# EAGLE design NervousSys_V4 (EAGLE 9.1.0)
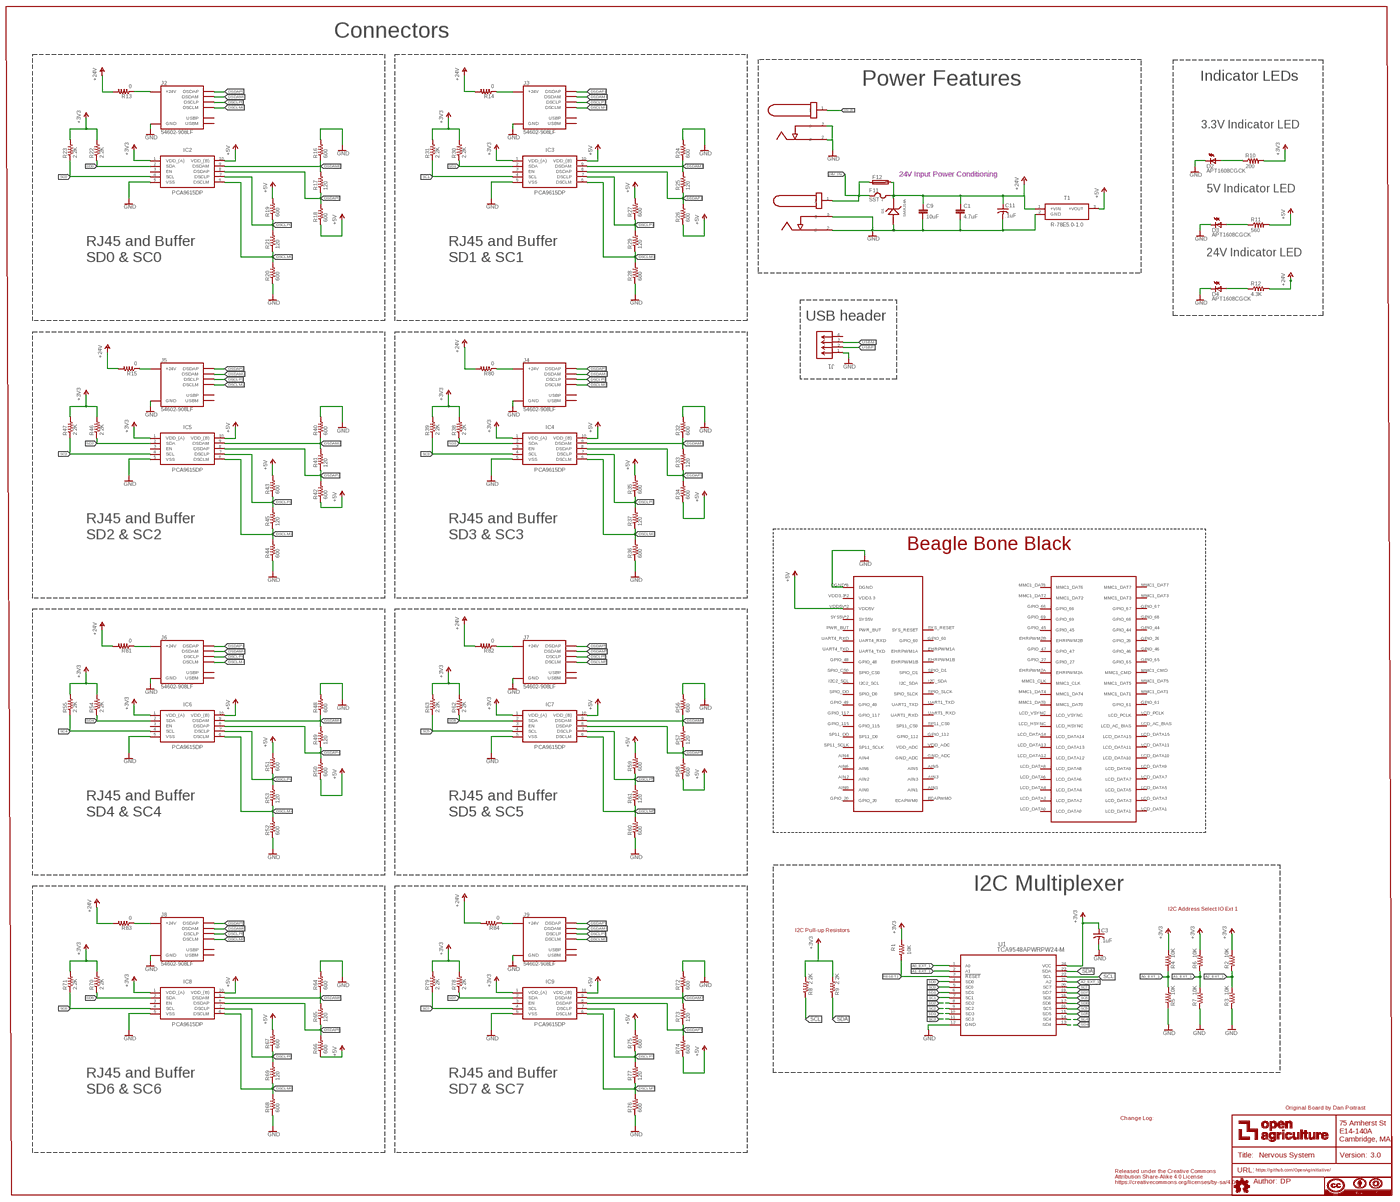
[diagram p0: schematic, sheet 1, overview]
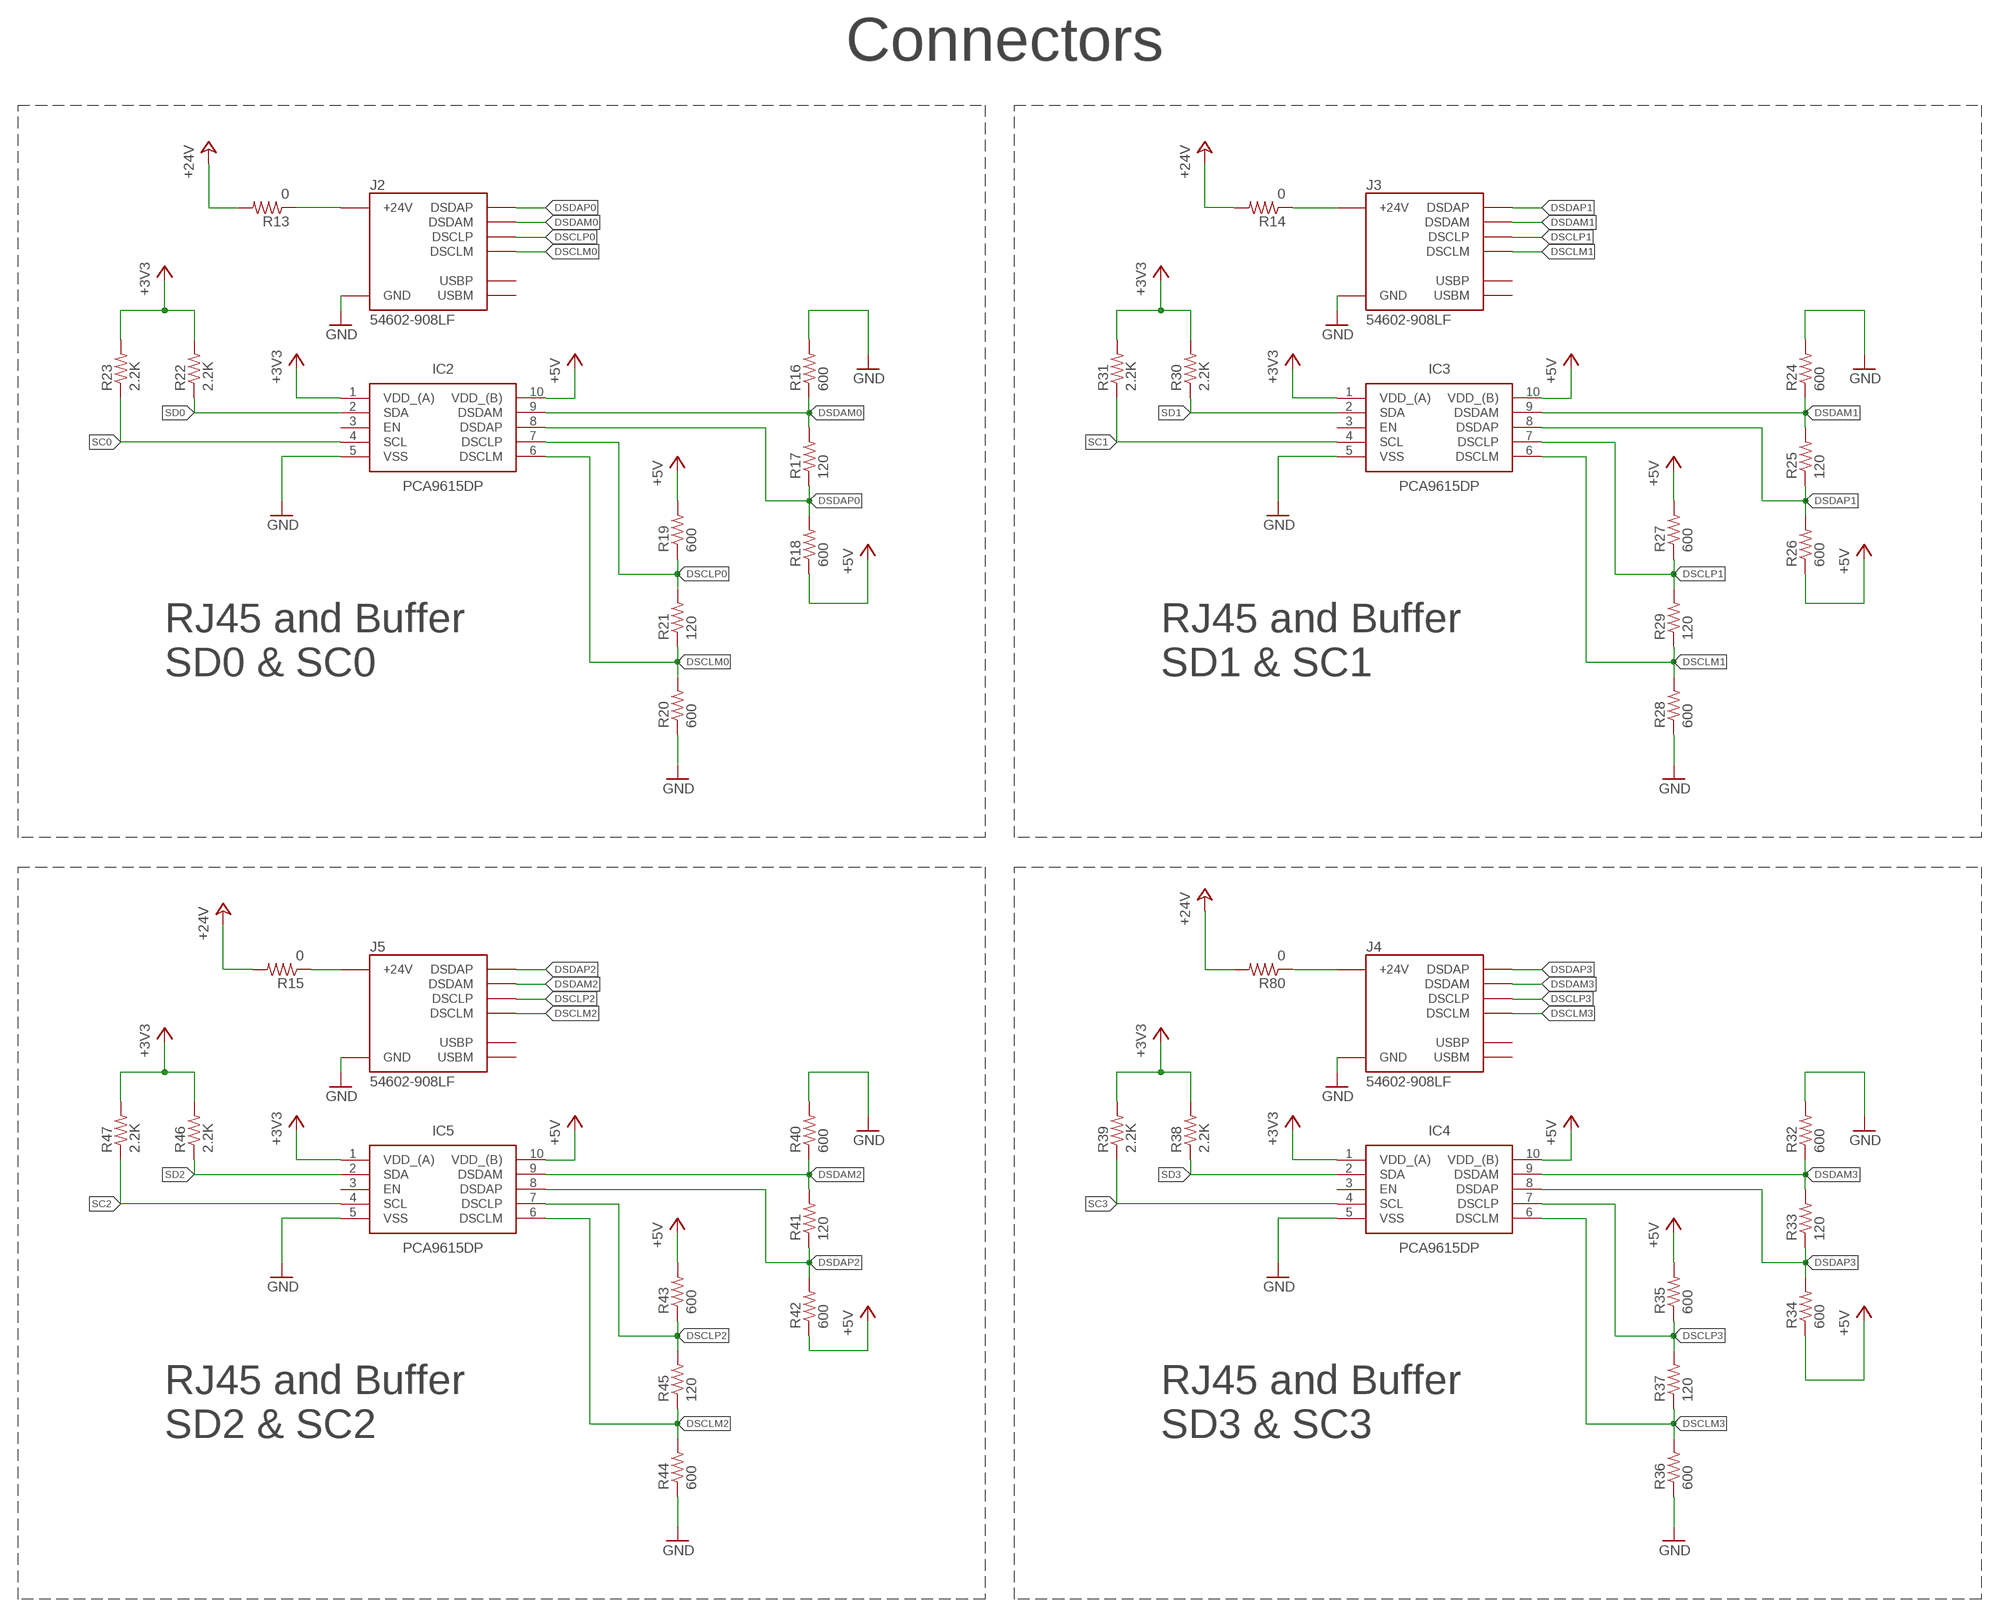
[diagram p1: schematic, sheet 1, part 1 of 4]
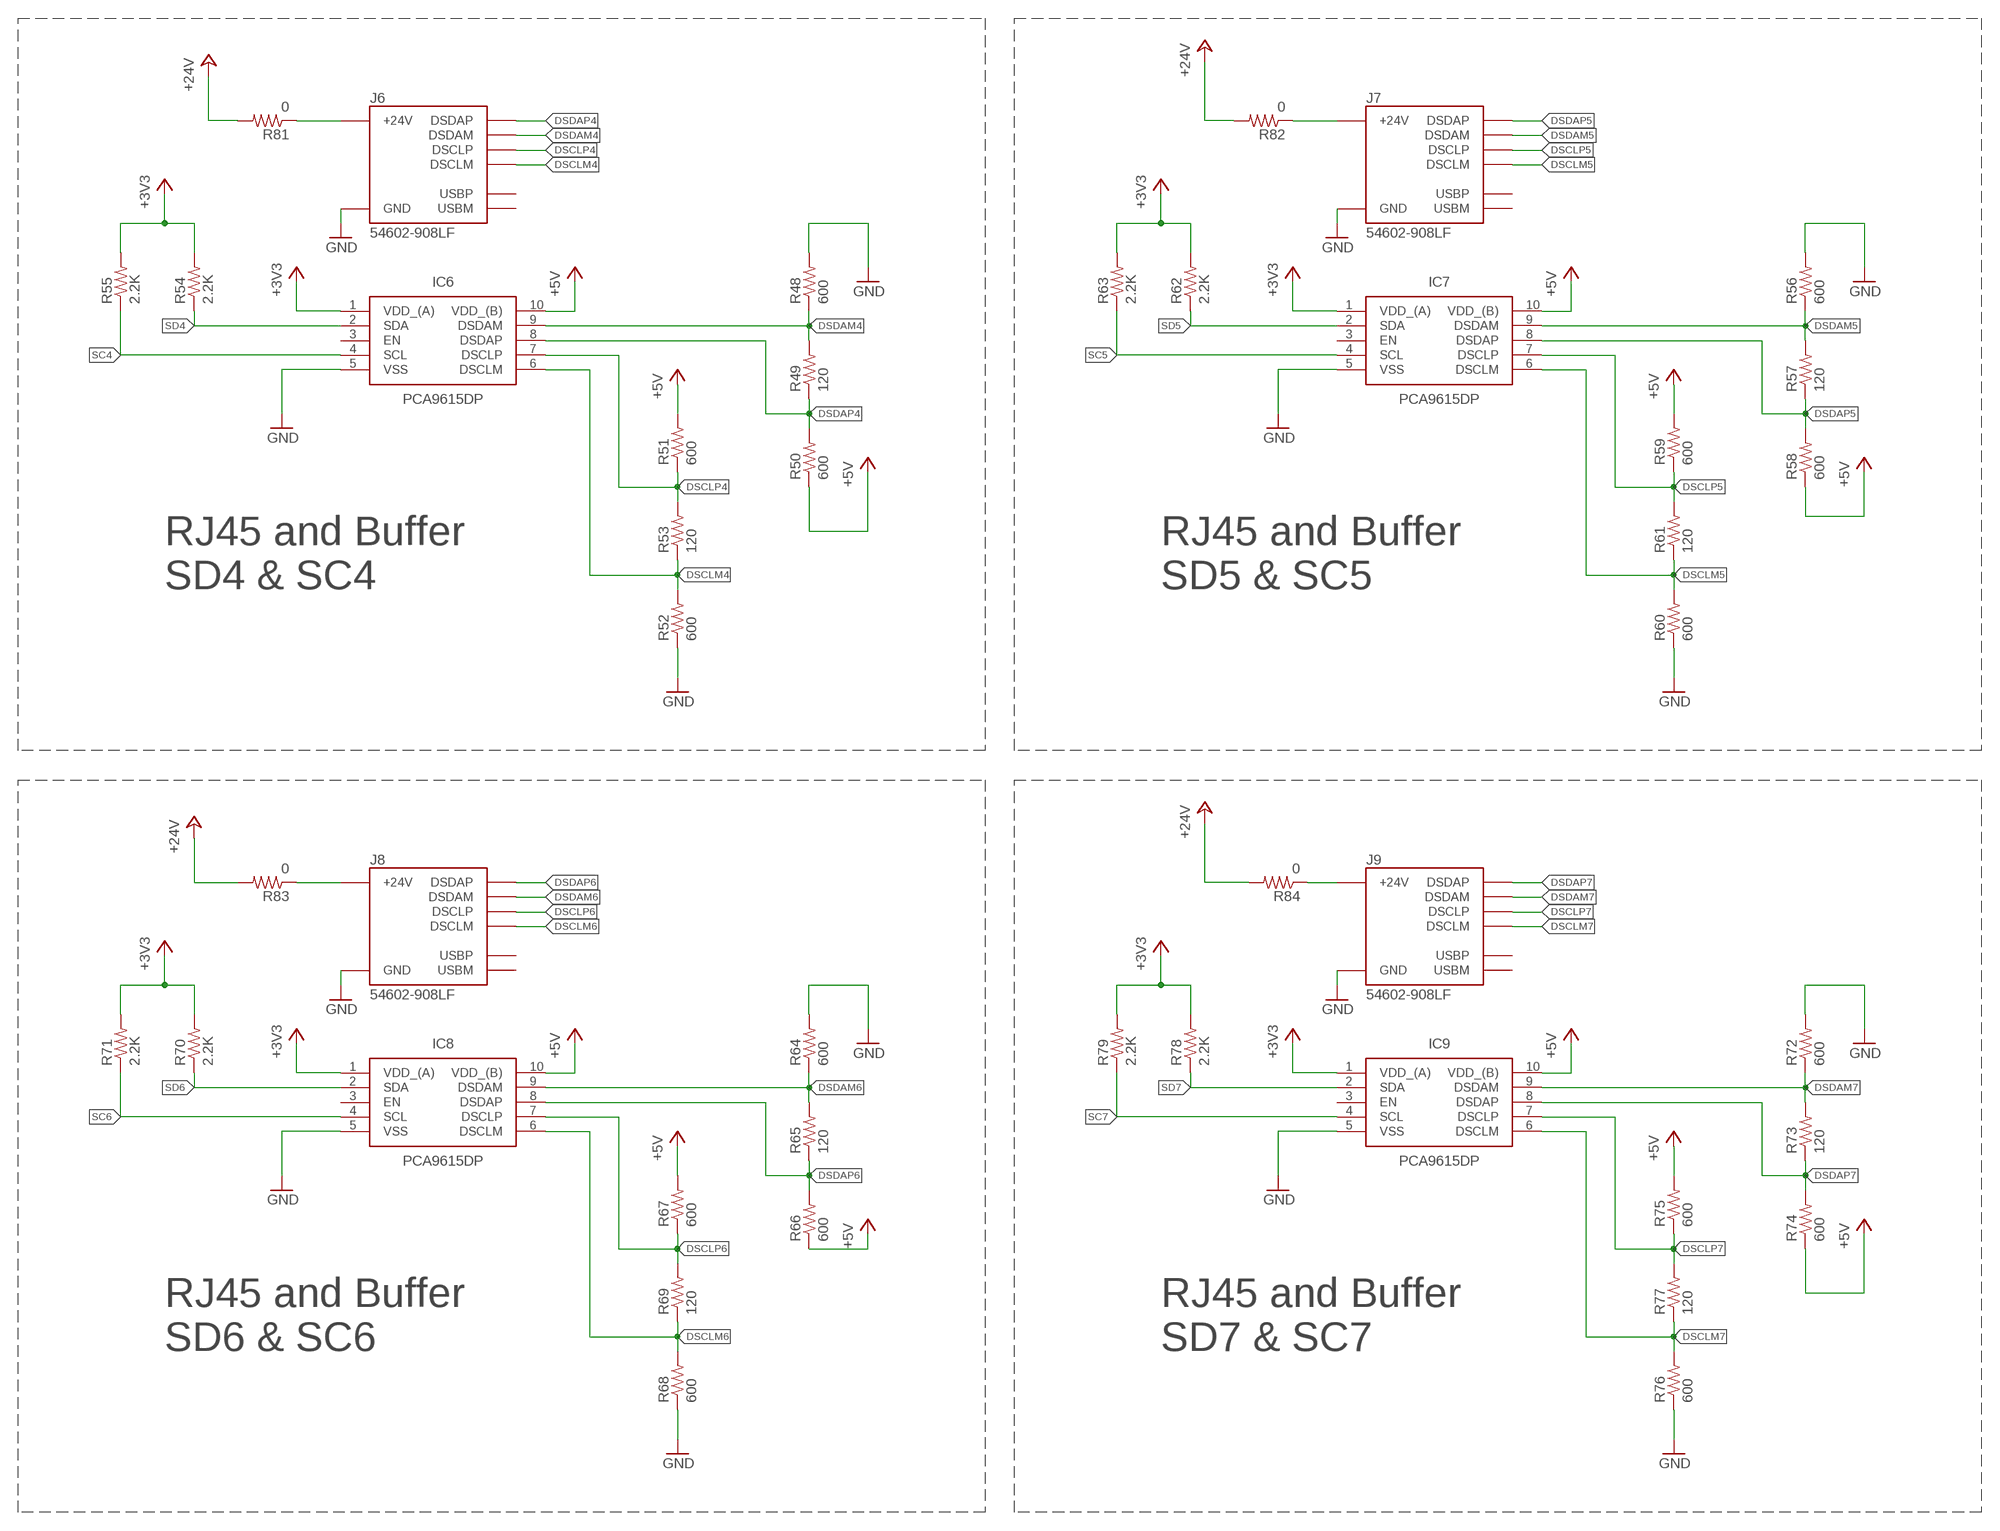
[diagram p2: schematic, sheet 1, part 2 of 4]
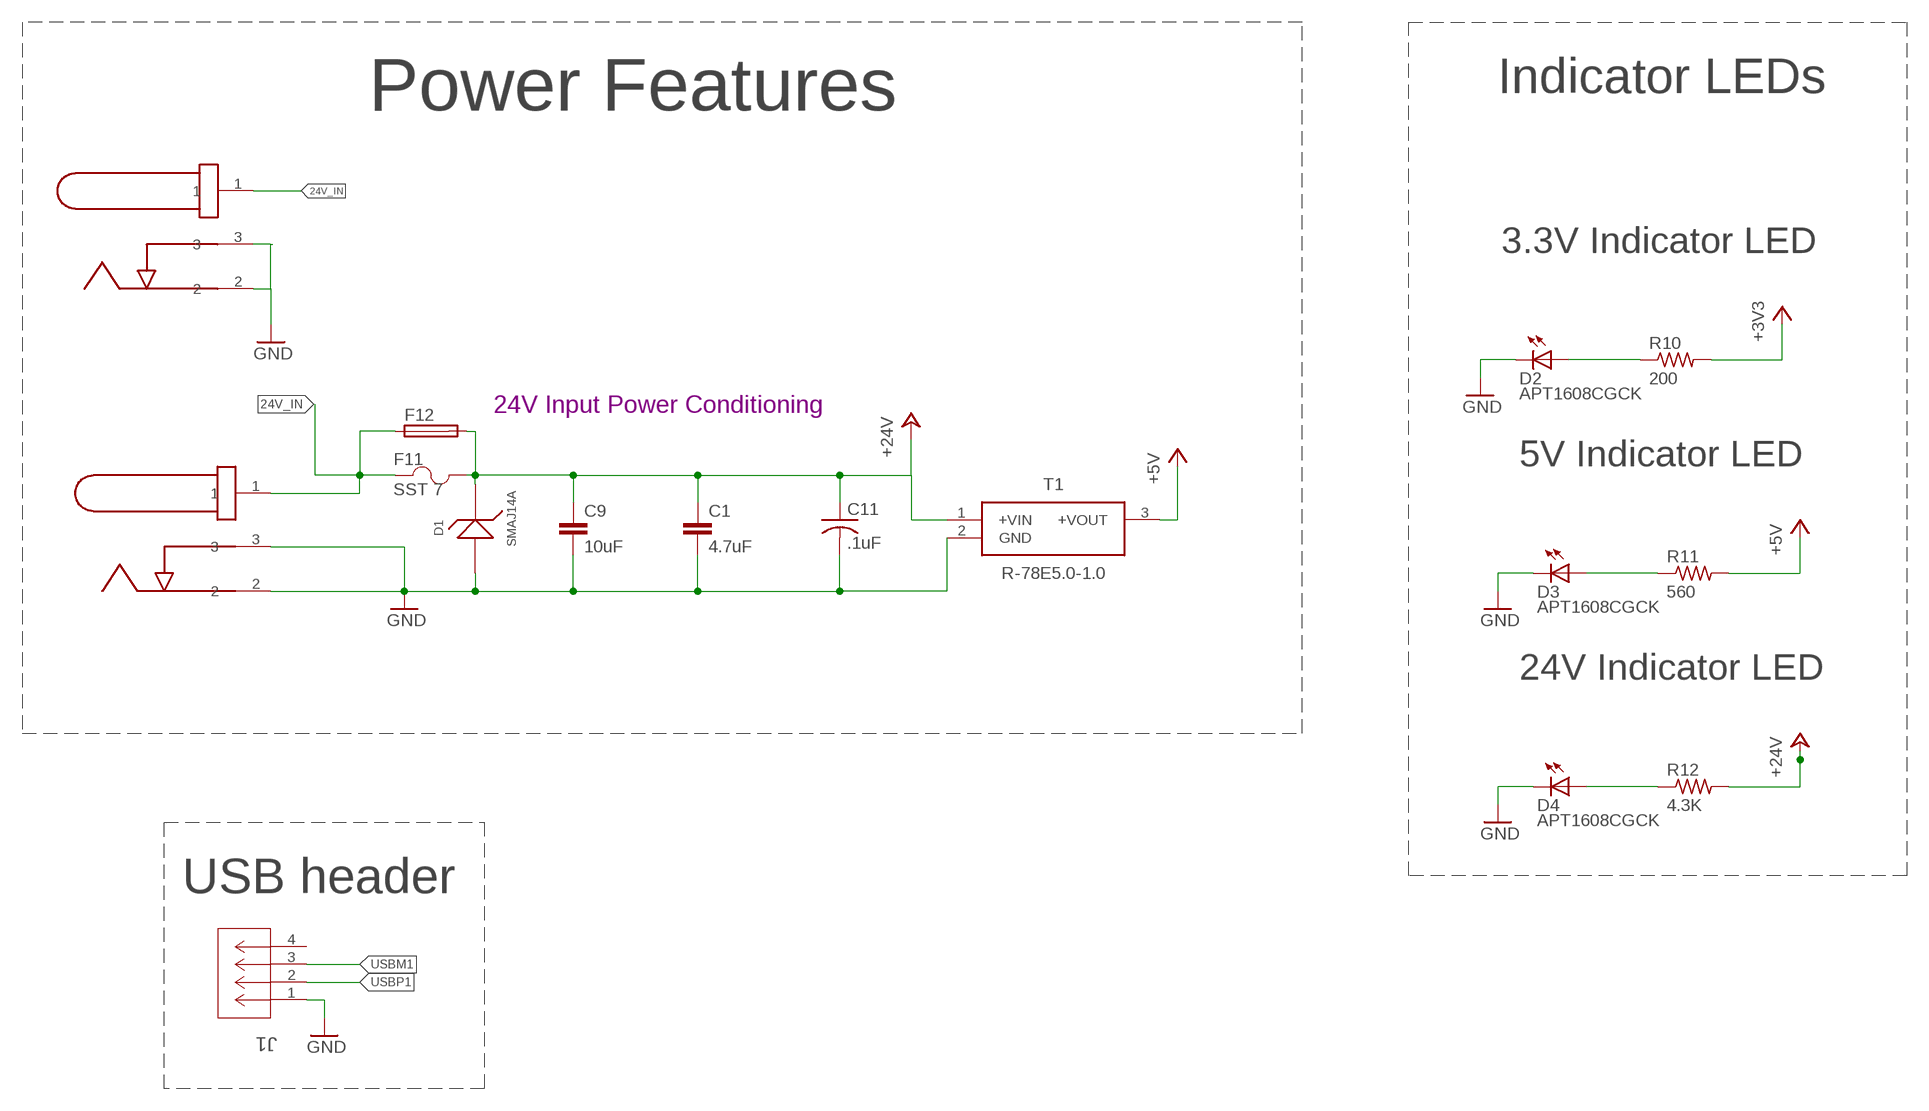
[diagram p3: schematic, sheet 1, part 3 of 4]
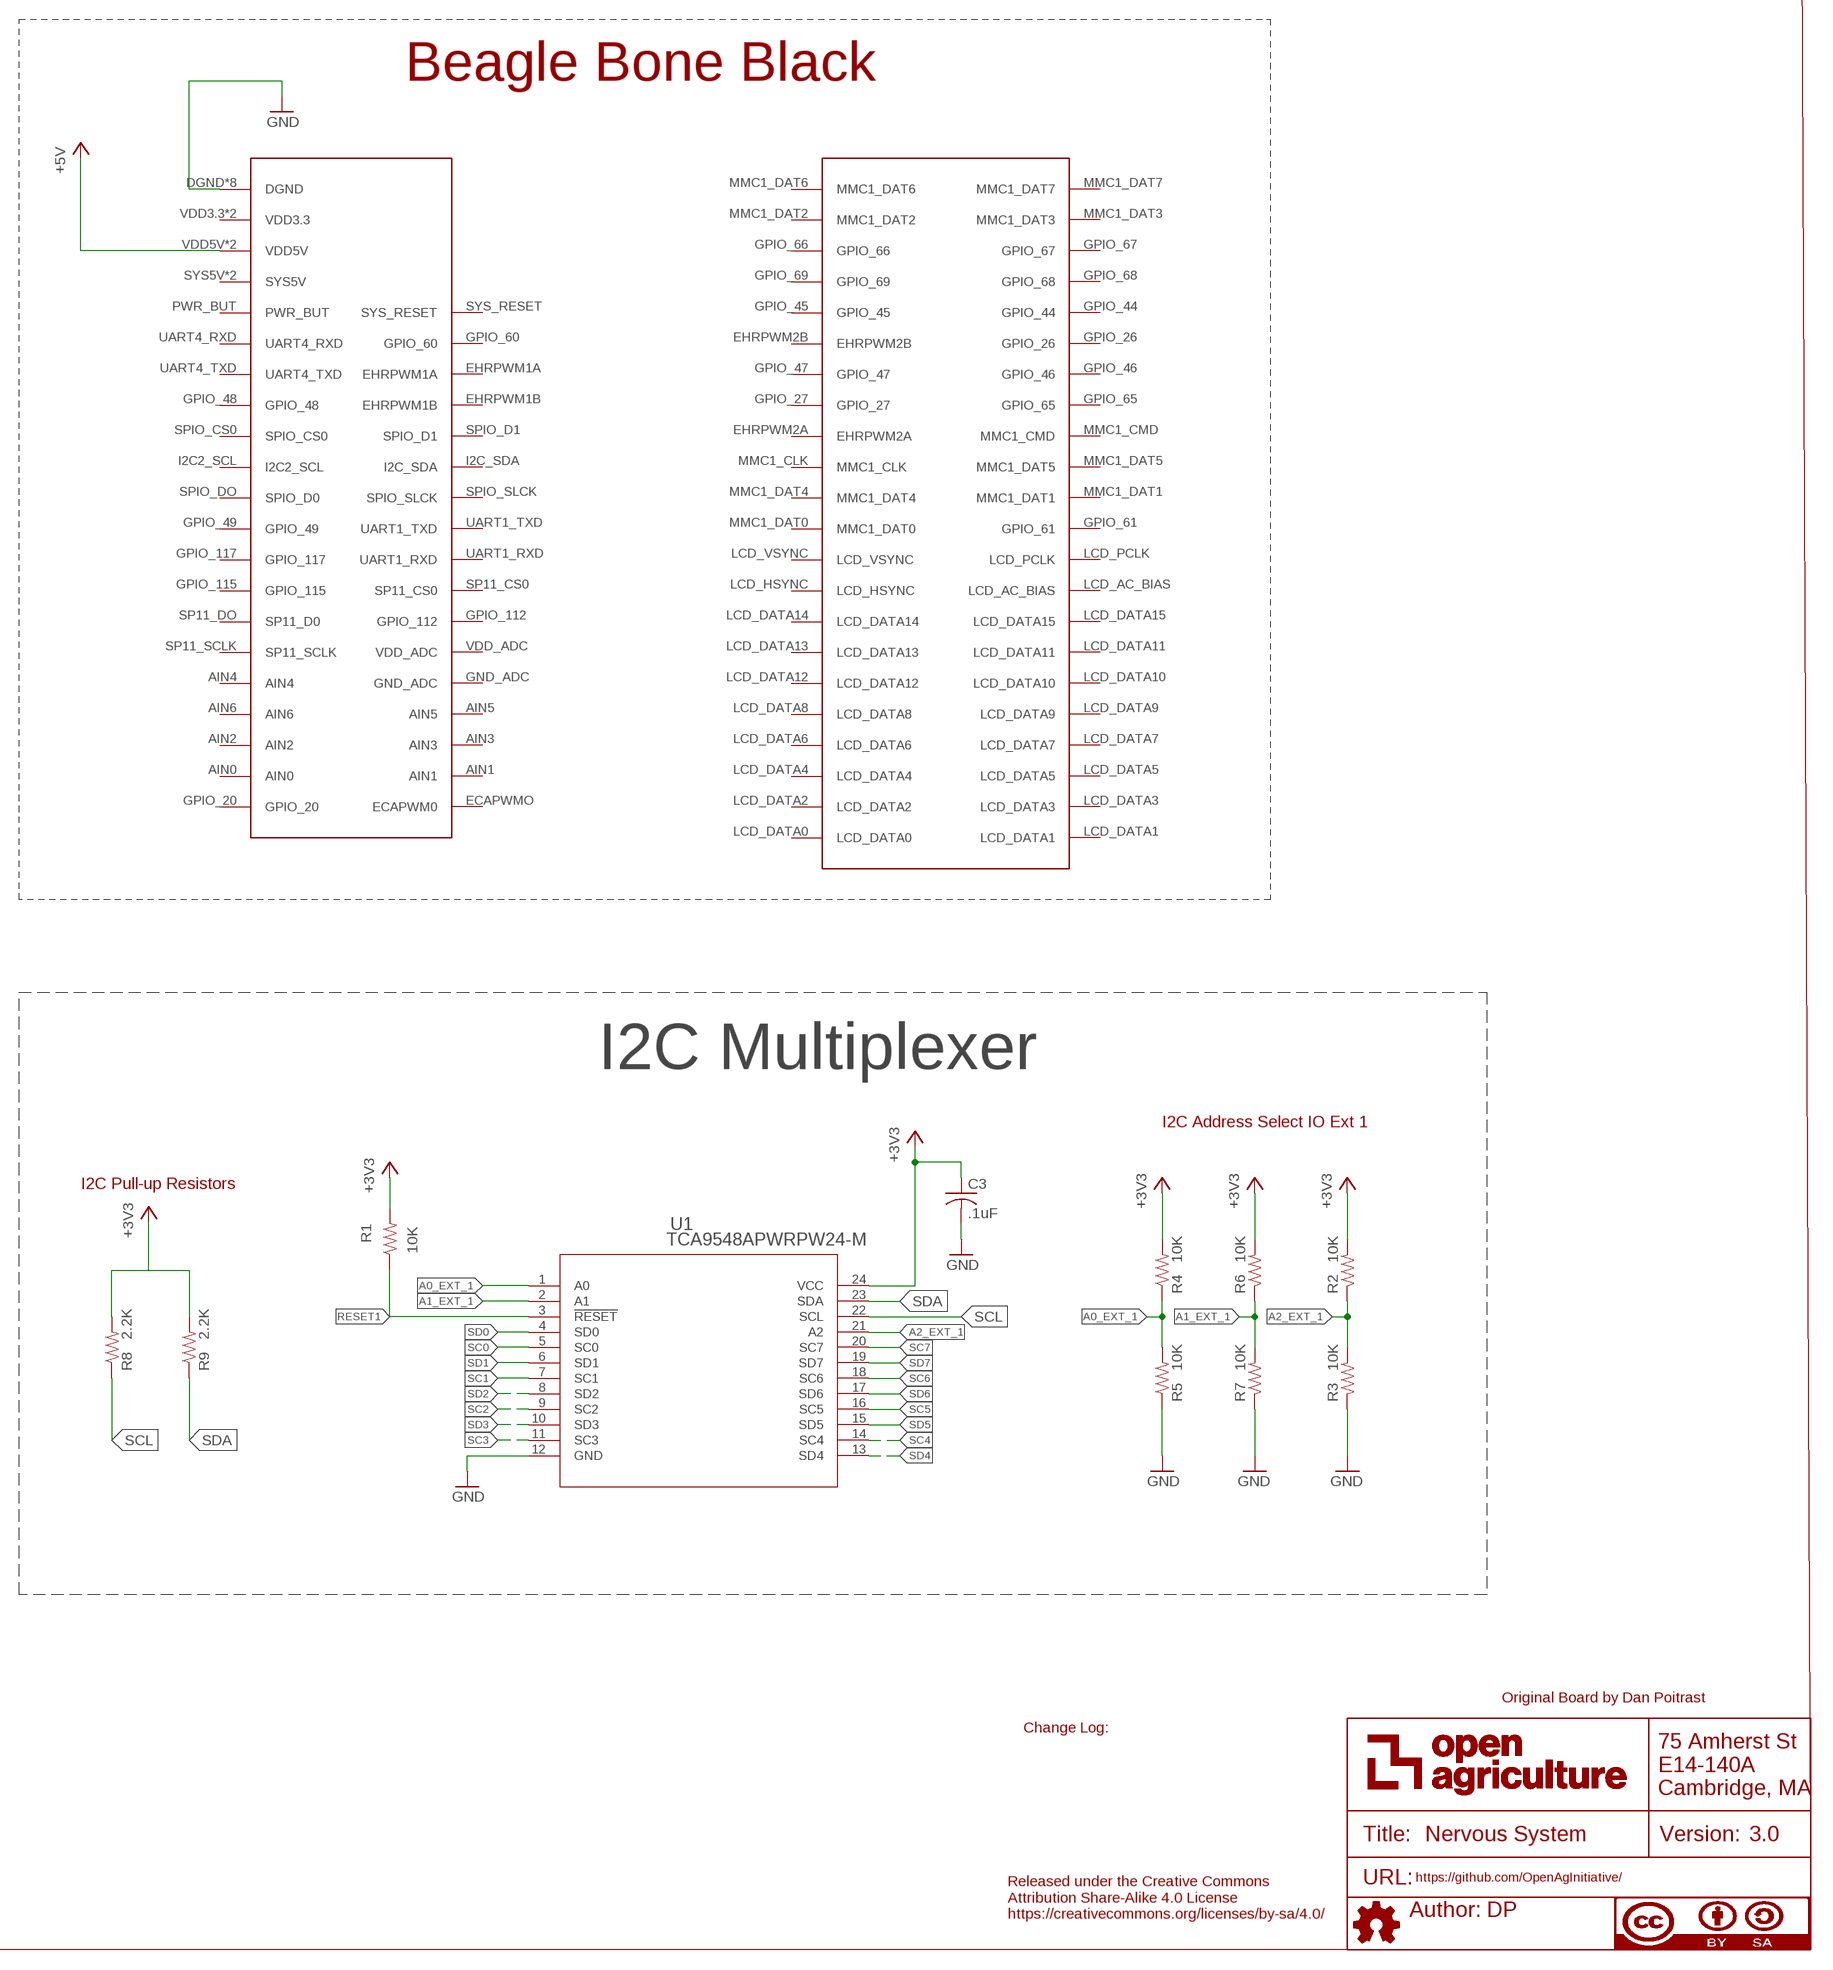
[diagram p4: schematic, sheet 1, part 4 of 4]

## Parts
ATTRIBUTES  DOCFIELD  [DOCFIELD]
C1  4.7uF  4.7UF-C1206C475K5PACTU  [CAP_C1206]
C3  .1uF  C-USC0603  [C0603@1]
C9  10uF  10UF-CL31B106KBHNNNE  [C1206]
C11  .1uF  C-USC0603  [C0603@1]
D1  SMAJ14A  [DO-214AC]
D2  APT1608CGCK  [CHIPLED_0603]
D3  APT1608CGCK  [CHIPLED_0603]
D4  APT1608CGCK  [CHIPLED_0603]
F11  SST 7  SST_7  [SS]
F12  GSH15  [GSH15]
IC2  PCA9615DP  [SOP50P490X110-10N]
IC3  PCA9615DP  [SOP50P490X110-10N]
IC4  PCA9615DP  [SOP50P490X110-10N]
IC5  PCA9615DP  [SOP50P490X110-10N]
IC6  PCA9615DP  [SOP50P490X110-10N]
IC7  PCA9615DP  [SOP50P490X110-10N]
IC8  PCA9615DP  [SOP50P490X110-10N]
IC9  PCA9615DP  [SOP50P490X110-10N]
J1  87583-2010BLF  [CONN_USB-87583]
J2  54602-908LF  OPENAG-V1-RJ45PTH  [OPENAG-V1-RJ45]
J3  54602-908LF  OPENAG-V1-RJ45PTH  [OPENAG-V1-RJ45]
J4  54602-908LF  OPENAG-V1-RJ45PTH  [OPENAG-V1-RJ45]
J5  54602-908LF  OPENAG-V1-RJ45PTH  [OPENAG-V1-RJ45]
J6  54602-908LF  OPENAG-V1-RJ45PTH  [OPENAG-V1-RJ45]
J7  54602-908LF  OPENAG-V1-RJ45PTH  [OPENAG-V1-RJ45]
J8  54602-908LF  OPENAG-V1-RJ45PTH  [OPENAG-V1-RJ45]
J9  54602-908LF  OPENAG-V1-RJ45PTH  [OPENAG-V1-RJ45]
R1  10K  R-US_R0603  [R0603]
R2  10K  10KOHM-1/10W-1%(0603)0603  [0603-RES]
R3  10K  10KOHM-1/10W-1%(0603)0603  [0603-RES]
R4  10K  10KOHM-1/10W-1%(0603)0603  [0603-RES]
R5  10K  10KOHM-1/10W-1%(0603)0603  [0603-RES]
R6  10K  10KOHM-1/10W-1%(0603)0603  [0603-RES]
R7  10K  10KOHM-1/10W-1%(0603)0603  [0603-RES]
R8  2.2K  10KOHM-1/10W-1%(0603)0603  [0603-RES]
R9  2.2K  10KOHM-1/10W-1%(0603)0603  [0603-RES]
R10  200  100OHM-RC0603JR-07100RL  [RC0603N]
R11  560  100OHM-RC0603JR-07100RL  [RC0603N]
R12  4.3K  100OHM-RC0603JR-07100RL  [RC0603N]
R13  0  R-US_R0603  [R0603]
R14  0  R-US_R0603  [R0603]
R15  0  R-US_R0603  [R0603]
R16  600  R-US_R0603  [R0603]
R17  120  R-US_R0603  [R0603]
R18  600  R-US_R0603  [R0603]
R19  600  R-US_R0603  [R0603]
R20  600  R-US_R0603  [R0603]
R21  120  R-US_R0603  [R0603]
R22  2.2K  R-US_R0603  [R0603]
R23  2.2K  R-US_R0603  [R0603]
R24  600  R-US_R0603  [R0603]
R25  120  R-US_R0603  [R0603]
R26  600  R-US_R0603  [R0603]
R27  600  R-US_R0603  [R0603]
R28  600  R-US_R0603  [R0603]
R29  120  R-US_R0603  [R0603]
R30  2.2K  R-US_R0603  [R0603]
R31  2.2K  R-US_R0603  [R0603]
R32  600  R-US_R0603  [R0603]
R33  120  R-US_R0603  [R0603]
R34  600  R-US_R0603  [R0603]
R35  600  R-US_R0603  [R0603]
R36  600  R-US_R0603  [R0603]
R37  120  R-US_R0603  [R0603]
R38  2.2K  R-US_R0603  [R0603]
R39  2.2K  R-US_R0603  [R0603]
R40  600  R-US_R0603  [R0603]
R41  120  R-US_R0603  [R0603]
R42  600  R-US_R0603  [R0603]
R43  600  R-US_R0603  [R0603]
R44  600  R-US_R0603  [R0603]
R45  120  R-US_R0603  [R0603]
R46  2.2K  R-US_R0603  [R0603]
R47  2.2K  R-US_R0603  [R0603]
R48  600  R-US_R0603  [R0603]
R49  120  R-US_R0603  [R0603]
R50  600  R-US_R0603  [R0603]
R51  600  R-US_R0603  [R0603]
R52  600  R-US_R0603  [R0603]
R53  120  R-US_R0603  [R0603]
R54  2.2K  R-US_R0603  [R0603]
R55  2.2K  R-US_R0603  [R0603]
R56  600  R-US_R0603  [R0603]
R57  120  R-US_R0603  [R0603]
R58  600  R-US_R0603  [R0603]
R59  600  R-US_R0603  [R0603]
R60  600  R-US_R0603  [R0603]
R61  120  R-US_R0603  [R0603]
R62  2.2K  R-US_R0603  [R0603]
R63  2.2K  R-US_R0603  [R0603]
R64  600  R-US_R0603  [R0603]
R65  120  R-US_R0603  [R0603]
R66  600  R-US_R0603  [R0603]
R67  600  R-US_R0603  [R0603]
R68  600  R-US_R0603  [R0603]
R69  120  R-US_R0603  [R0603]
R70  2.2K  R-US_R0603  [R0603]
R71  2.2K  R-US_R0603  [R0603]
R72  600  R-US_R0603  [R0603]
R73  120  R-US_R0603  [R0603]
R74  600  R-US_R0603  [R0603]
R75  600  R-US_R0603  [R0603]
R76  600  R-US_R0603  [R0603]
R77  120  R-US_R0603  [R0603]
R78  2.2K  R-US_R0603  [R0603]
R79  2.2K  R-US_R0603  [R0603]
R80  0  R-US_R0603  [R0603]
R81  0  R-US_R0603  [R0603]
R82  0  R-US_R0603  [R0603]
R83  0  R-US_R0603  [R0603]
R84  0  R-US_R0603  [R0603]
T1  R-78E5.0-1.0  [R-78E5.0-1.0]
U1  TCA9548APWRPW24-M  [PW24-M]
U$1  PJ-036AH  [PJ-036AH]
U$3  PJ-036AH  [PJ-036AH]
U$4  BBB_SMD  [23PINHEADERSMD]

## Nets
24V_IN: F11.1 F12.1 U$1.1 U$3.1
+3V3: C3.1 IC2.1(VDD_(A)) IC3.1(VDD_(A)) IC4.1(VDD_(A)) IC5.1(VDD_(A)) IC6.1(VDD_(A)) IC7.1(VDD_(A)) IC8.1(VDD_(A)) IC9.1(VDD_(A)) R1.2 R2.2 R4.2 R6.2 R8.2 R9.2 R10.2 R22.2 R23.2 R30.2 R31.2 R38.2 R39.2 R46.2 R47.2 R54.2 R55.2 R62.2 R63.2 R70.2 R71.2 R78.2 R79.2 U1.24(VCC)
+5V: IC2.10(VDD_(B)) IC3.10(VDD_(B)) IC4.10(VDD_(B)) IC5.10(VDD_(B)) IC6.10(VDD_(B)) IC7.10(VDD_(B)) IC8.10(VDD_(B)) IC9.10(VDD_(B)) R11.2 R18.1 R19.2 R26.1 R27.2 R34.1 R35.2 R42.1 R43.2 R50.1 R51.2 R58.1 R59.2 R66.1 R67.2 R74.1 R75.2 T1.3(+VOUT) U$4.VDD5V U$4.VDD5V1(VDD5V)
+24V: C1.1 C9.1 C11.1 D1.C F11.2 F12.2 R12.2 R13.2 R14.2 R15.2 R80.2 R81.2 R82.2 R83.2 R84.2 T1.1(+VIN)
A0_EXT_1: R4.1 R5.2 U1.1(A0)
A1_EXT_1: R6.1 R7.2 U1.2(A1)
A2_EXT_1: R2.1 R3.2 U1.21(A2)
DSCLM0: IC2.6(DSCLM) J2.DSCLM(5)(DSCLM) R20.2 R21.1
DSCLM1: IC3.6(DSCLM) J3.DSCLM(5)(DSCLM) R28.2 R29.1
DSCLM2: IC5.6(DSCLM) J5.DSCLM(5)(DSCLM) R44.2 R45.1
DSCLM3: IC4.6(DSCLM) J4.DSCLM(5)(DSCLM) R36.2 R37.1
DSCLM4: IC6.6(DSCLM) J6.DSCLM(5)(DSCLM) R52.2 R53.1
DSCLM5: IC7.6(DSCLM) J7.DSCLM(5)(DSCLM) R60.2 R61.1
DSCLM6: IC8.6(DSCLM) J8.DSCLM(5)(DSCLM) R68.2 R69.1
DSCLM7: IC9.6(DSCLM) J9.DSCLM(5)(DSCLM) R76.2 R77.1
DSCLP0: IC2.7(DSCLP) J2.DSCLP(4)(DSCLP) R19.1 R21.2
DSCLP1: IC3.7(DSCLP) J3.DSCLP(4)(DSCLP) R27.1 R29.2
DSCLP2: IC5.7(DSCLP) J5.DSCLP(4)(DSCLP) R43.1 R45.2
DSCLP3: IC4.7(DSCLP) J4.DSCLP(4)(DSCLP) R35.1 R37.2
DSCLP4: IC6.7(DSCLP) J6.DSCLP(4)(DSCLP) R51.1 R53.2
DSCLP5: IC7.7(DSCLP) J7.DSCLP(4)(DSCLP) R59.1 R61.2
DSCLP6: IC8.7(DSCLP) J8.DSCLP(4)(DSCLP) R67.1 R69.2
DSCLP7: IC9.7(DSCLP) J9.DSCLP(4)(DSCLP) R75.1 R77.2
DSDAM0: IC2.9(DSDAM) J2.DSDAM(2)(DSDAM) R16.1 R17.2
DSDAM1: IC3.9(DSDAM) J3.DSDAM(2)(DSDAM) R24.1 R25.2
DSDAM2: IC5.9(DSDAM) J5.DSDAM(2)(DSDAM) R40.1 R41.2
DSDAM3: IC4.9(DSDAM) J4.DSDAM(2)(DSDAM) R32.1 R33.2
DSDAM4: IC6.9(DSDAM) J6.DSDAM(2)(DSDAM) R48.1 R49.2
DSDAM5: IC7.9(DSDAM) J7.DSDAM(2)(DSDAM) R56.1 R57.2
DSDAM6: IC8.9(DSDAM) J8.DSDAM(2)(DSDAM) R64.1 R65.2
DSDAM7: IC9.9(DSDAM) J9.DSDAM(2)(DSDAM) R72.1 R73.2
DSDAP0: IC2.8(DSDAP) J2.DSDAP(1)(DSDAP) R17.1 R18.2
DSDAP1: IC3.8(DSDAP) J3.DSDAP(1)(DSDAP) R25.1 R26.2
DSDAP2: IC5.8(DSDAP) J5.DSDAP(1)(DSDAP) R41.1 R42.2
DSDAP3: IC4.8(DSDAP) J4.DSDAP(1)(DSDAP) R33.1 R34.2
DSDAP4: IC6.8(DSDAP) J6.DSDAP(1)(DSDAP) R49.1 R50.2
DSDAP5: IC7.8(DSDAP) J7.DSDAP(1)(DSDAP) R57.1 R58.2
DSDAP6: IC8.8(DSDAP) J8.DSDAP(1)(DSDAP) R65.1 R66.2
DSDAP7: IC9.8(DSDAP) J9.DSDAP(1)(DSDAP) R73.1 R74.2
GND: C1.2 C3.2 C9.2 C11.2 D1.A D2.C D3.C D4.C IC2.5(VSS) IC3.5(VSS) IC4.5(VSS) IC5.5(VSS) IC6.5(VSS) IC7.5(VSS) IC8.5(VSS) IC9.5(VSS) J1.1 J2.GND(3)(GND) J3.GND(3)(GND) J4.GND(3)(GND) J5.GND(3)(GND) J6.GND(3)(GND) J7.GND(3)(GND) J8.GND(3)(GND) J9.GND(3)(GND) R3.1 R5.1 R7.1 R16.2 R20.1 R24.2 R28.1 R32.2 R36.1 R40.2 R44.1 R48.2 R52.1 R56.2 R60.1 R64.2 R68.1 R72.2 R76.1 T1.2(GND) U1.12(GND) U$1.2 U$1.3 U$3.2 U$3.3 U$4.DGND U$4.DGND1(DGND) U$4.DGND2(DGND) U$4.DGND3(DGND) U$4.DGND4(DGND) U$4.DGND5(DGND) U$4.DGND6(DGND) U$4.DGND7(DGND)
N$1: J2.24V(6)(+24V) R13.1
N$2: D3.A R11.1
N$3: J3.24V(6)(+24V) R14.1
N$4: D4.A R12.1
N$5: J5.24V(6)(+24V) R15.1
N$6: J4.24V(6)(+24V) R80.1
N$7: J6.24V(6)(+24V) R81.1
N$8: J7.24V(6)(+24V) R82.1
N$9: J8.24V(6)(+24V) R83.1
N$10: J9.24V(6)(+24V) R84.1
N$12: D2.A R10.1
RESET1: R1.1 U1.3(!RESET)
SC0: IC2.4(SCL) R23.1 U1.5(SC0)
SC1: IC3.4(SCL) R31.1 U1.7(SC1)
SC2: IC5.4(SCL) R47.1 U1.9(SC2)
SC3: IC4.4(SCL) R39.1 U1.11(SC3)
SC4: IC6.4(SCL) R55.1 U1.14(SC4)
SC5: IC7.4(SCL) R63.1 U1.16(SC5)
SC6: IC8.4(SCL) R71.1 U1.18(SC6)
SC7: IC9.4(SCL) R79.1 U1.20(SC7)
SCL: R8.1 U1.22(SCL)
SD0: IC2.2(SDA) R22.1 U1.4(SD0)
SD1: IC3.2(SDA) R30.1 U1.6(SD1)
SD2: IC5.2(SDA) R46.1 U1.8(SD2)
SD3: IC4.2(SDA) R38.1 U1.10(SD3)
SD4: IC6.2(SDA) R54.1 U1.13(SD4)
SD5: IC7.2(SDA) R62.1 U1.15(SD5)
SD6: IC8.2(SDA) R70.1 U1.17(SD6)
SD7: IC9.2(SDA) R78.1 U1.19(SD7)
SDA: R9.1 U1.23(SDA)
USBM1: J1.3
USBP1: J1.2
Unconnected: IC2.3(EN) IC3.3(EN) IC4.3(EN) IC5.3(EN) IC6.3(EN) IC7.3(EN) IC8.3(EN) IC9.3(EN) J1.4 J2.USBM(8)(USBM) J2.USBP(7)(USBP) J3.USBM(8)(USBM) J3.USBP(7)(USBP) J4.USBM(8)(USBM) J4.USBP(7)(USBP) J5.USBM(8)(USBM) J5.USBP(7)(USBP) J6.USBM(8)(USBM) J6.USBP(7)(USBP) J7.USBM(8)(USBM) J7.USBP(7)(USBP) J8.USBM(8)(USBM) J8.USBP(7)(USBP) J9.USBM(8)(USBM) J9.USBP(7)(USBP) U$4.AIN0 U$4.AIN1 U$4.AIN2 U$4.AIN3 U$4.AIN4 U$4.AIN5 U$4.AIN6 U$4.ECAPWMO(ECAPWM0) U$4.EHRPWM1A U$4.EHRPWM1B U$4.EHRPWM2A U$4.EHRPWM2B U$4.GND_ADC U$4.GPIO_20 U$4.GPIO_26 U$4.GPIO_27 U$4.GPIO_44 U$4.GPIO_45 U$4.GPIO_46 U$4.GPIO_47 U$4.GPIO_48 U$4.GPIO_49 U$4.GPIO_60 U$4.GPIO_61 U$4.GPIO_65 U$4.GPIO_66 U$4.GPIO_67 U$4.GPIO_68 U$4.GPIO_69 U$4.GPIO_112 U$4.GPIO_115 U$4.GPIO_117 U$4.I2C2_SCL U$4.I2C_SDA U$4.LCD_AC_BIAS U$4.LCD_DATA0 U$4.LCD_DATA1 U$4.LCD_DATA2 U$4.LCD_DATA3 U$4.LCD_DATA4 U$4.LCD_DATA5 U$4.LCD_DATA6 U$4.LCD_DATA7 U$4.LCD_DATA8 U$4.LCD_DATA9 U$4.LCD_DATA10 U$4.LCD_DATA11 U$4.LCD_DATA12 U$4.LCD_DATA13 U$4.LCD_DATA14 U$4.LCD_DATA15 U$4.LCD_HSYNC U$4.LCD_PCLK U$4.LCD_VSYNC U$4.MMC1_CLK U$4.MMC1_CMD U$4.MMC1_DAT0 U$4.MMC1_DAT1 U$4.MMC1_DAT2 U$4.MMC1_DAT3 U$4.MMC1_DAT4 U$4.MMC1_DAT5 U$4.MMC1_DAT6 U$4.MMC1_DAT7 U$4.PWR_BUT U$4.SP11_CS0 U$4.SP11_DO(SP11_D0) U$4.SP11_SCLK U$4.SPIO_CS0 U$4.SPIO_D1 U$4.SPIO_DO(SPIO_D0) U$4.SPIO_SLCK U$4.SYS5V U$4.SYS5V1(SYS5V) U$4.SYS_RESET U$4.UART1_RXD U$4.UART1_TXD U$4.UART4_RXD U$4.UART4_TXD U$4.VDD3.3 U$4.VDD3.31(VDD3.3) U$4.VDD_ADC

## Notes on the sheet
- Connectors
- Indicator LEDs
- Power Features
- 3.3V Indicator LED
- 24V Input Power Conditioning
- 5V Indicator LED
- 24V Indicator LED
- RJ45 and Buffer
  SD0 & SC0
- RJ45 and Buffer
  SD1 & SC1
- USB header
- RJ45 and Buffer
  SD2 & SC2
- RJ45 and Buffer
  SD3 & SC3
- RJ45 and Buffer
  SD4 & SC4
- RJ45 and Buffer
  SD5 & SC5
- I2C Multiplexer
- I2C Address Select IO Ext 1
- I2C Pull-up Resistors
- RJ45 and Buffer
  SD6 & SC6
- RJ45 and Buffer
  SD7 & SC7
- Original Board by Dan Poitrast
- Change Log:
- Released under the Creative Commons
  Attribution Share-Alike 4.0 License
  https://creativecommons.org/licenses/by-sa/4.0/

## Library data of the parts
ATTRIBUTES = openag-frames:DOCFIELD: DOCUMENT FIELD; AUTHOR: DP; DESCRIPTION: Nervous System; TITLE: Nervous System; URL: https://github.com/OpenAgInitiative/; VER: 3.0
C1 = openag-capacitors:4.7UF-C1206C475K5PACTU: Kemet - C1206C475K5PACTU - CAP CER 4.7UF 50V X5R 1206 Description: 4.7�F �10% 50V Ceramic Capacitor X5R 1206 (3216 Metric) Technical Specifications: Capacitance: 4.7uF Tolerance: ±10% Rated Voltage: 50V Temperature Coefficient: X5R Operating Temperature: -55°C ~ 85°C Package/Case: 1206 (3216 Metric) Datasheet(s): https://media.digikey.com/pdf/Data%20Sheets/Kemet%20PDFs/C1206C475K5PAC.pdf Vendor(s): Digikey: 399-5507-1-ND <https://www.digikey.com/product-detail/en/kemet/C1206C475K5PACTU/399-5507-1-ND/1950685>; POPULATE: YES; VERIFIED: NO
C3 C11 = rcl:C-US: CAPACITOR, American symbol
C9 = openag-capacitors:10UF-CL31B106KBHNNNE: Samsung - CL31B106KBHNNNE - CAP CER 10UF 50V X7R 1206 Description: 10�F �10% 50V Ceramic Capacitor X7R 1206 (3216 Metric) Technical Specifications: Capacitance: 10uF Tolerance: ±10% Rated Voltage: 50V Temperature Coefficient: X7R Operating Temperature: -55°C ~ -125°C Package/Case: 1206 (3216 Metric) Datasheet(s): CL Series, MLCC Datasheet <https://media.digikey.com/pdf/Data%20Sheets/Samsung%20PDFs/CL_Series_MLCC_ds.pdf> Vendor(s): Digikey: 1276-6767-1-ND <https://www.digikey.com/product-detail/en/samsung-electro-mechanics-america-inc/CL31B106KBHNNNE/1276-6767-1-ND/5961626>; POPULATE: YES; VERIFIED: NO
D1 = openag-diodes:SMAJ14A: TVS DIODE 14VWM 23.2VC SMA - Littlefuse - SMAJ14A - SMAJ14ALFCT-ND Description: The SMAJ series is designed specifically to protect sensitive electronic equipment from voltage transients induced by lightning and other transient voltage events Technical Specifications: Type: Zener Voltage - Reverse Standoff (Typ): 14V Voltage - Breakdown (Min): 15.6V Voltage - Clamping (Max) @ Ipp: 23.2V Current - Peak Pulse (10/1000�s): 17.2A Operating Temperature: -55�C ~ 150�C (TJ) Mounting Type: Surface Mount Package / Case: DO-214AC, SMA Datasheet(s): SMAJ Series <http://www.littelfuse.com/~/media/electronics/datasheets/tvs_diodes/littelfuse_tvs_diode_smaj_datasheet.pdf.pdf> Vendor(s): Digikey: SMAJ14ALFCT-ND <https://www.digikey.com/product-detail/en/littelfuse-inc/SMAJ14A/SMAJ14ALFCT-ND/762486>; POPULATE: YES; VERIFIED: NO
D2-D4 = openag-diodes:APT1608CGCK: Kingbright - APT1608CGCK - LED GREEN CLEAR 0603 SMD Description: Green 570nm LED Indication - Discrete 2.1V 0603 (1608 Metric) Technical Specifications: Color: Green Lens Color: Colorless Lens Transparency: Clear Millicandela Rating: 50mcd Lens Style/Size: Rectangle with Flat Top, 1.20mm x 0.80mm Voltage - Forward (Vf) (Typ): 2.1V Current - Test: 20mA Viewing Angle: 120° Mounting Type: Surface Mount Wavelength - Dominant: 570nm Wavelength - Peak: 574nm Package / Case: 0603 (1608 Metric) Supplier Device Package: Chip LED Size / Dimension: 1.60mm L x 0.80mm W Height (Max): 0.75mm Datasheet(s): APT1608CGCK <http://www.kingbrightusa.com/images/catalog/SPEC/APT1608CGCK.pdf> Vendor(s): Digikey: 754-1116-1-ND <https://www.digikey.com/product-detail/en/kingbright/APT1608CGCK/754-1116-1-ND/1747833#>; POPULATE: YES; VERIFIED: NO
F11 = openag-fuses:SST_7: Bel Fuse - SST7 - FUSE BRD MNT 7A 125VAC/VDC 2SMD Description: FUSE BRD MNT 7A 125VAC/VDC 2SMD Technical Specifications: Current Rating: 7A Voltage Rating: 125V Fuse Type: Board Mount (Cartridge Style Excluded) Mounting Type: Surface Mount Operating Temperature: -55�C ~ 125�C Datasheet(s): SST Type <https://belfuse.com/resources/StewartConnector/SST.pdf> Vendor(s): Digikey: 507-1072-1-ND <https://www.digikey.com/product-detail/en/bel-fuse-inc/SST-7/507-1072-1-ND/615026>; POPULATE: YES; VERIFIED: NO
F12 = fuse:GSH15: FUSE HOLDER grid 15mm, 19649 Wickmann; MPN: 64900001039; OC_FARNELL: 1271673; OC_NEWARK: 02P0318
IC2-IC9 = PCA9615DP:PCA9615DP: Buffer, ReDriver 2 Channel 400kHz 10-TSSOP Source: Datasheet <http://www.nxp.com/docs/en/data-sheet/PCA9615.pdf>; DESCRIPTION: Buffer, ReDriver 2 Channel 400kHz 10-TSSOP; HEIGHT: 1.1mm; MANUFACTURER_NAME: Nexperia; MANUFACTURER_PART_NUMBER: PCA9615DP; SUPPLIER_NAME: RS
J1 = openag-connectors:87583-2010BLF; MANUFACTURER_PART_NUMBER: 875832010BLF; VENDOR: Amphenol FCI
J2-J9 = openag_connector:OPENAG-V1-RJ45: Amphenol FCI - 54602-908LF - CONN MOD JACK 8P8C R/A UNSHLD Description: Jack Modular Connector 8p8c (RJ45, Ethernet) 90� Angle (Right) Unshielded Cat3 Technical Specifications: Connector Type: Jack Number of Positions/Contacts: 8p8c (RJ45, Ethernet) Number of Ports: 1 Number of Rows: 1 Mounting Type: Through Hole Orientation: 90� Angle (Right) Termination: Solder Shielding: Unshielded Ratings: Cat3 Features: Board Lock LED Color: Does Not Contain LED Tab Direction: Down Contact Material: Copper Alloy Contact Finish: Gold Contact Finish Thickness: 15�in (0.38�m) Housing Material: Polyester, Glass Filled Operating Temperature: -40�C ~ 70�C Datasheet(s): 54601-x04(zzz)WPLF Drawing <http://cdn.amphenol-icc.com/media/wysiwyg/files/drawing/c-bmj-0102.pdf> Vendor(s): Digikey: 609-1046-ND <https://www.digikey.com/product-detail/en/amphenol-fci/54602-908LF/609-1046-ND/1001360>; POPULATE: YES; VERIFIED: NO
R1 R13-R84 = rcl:R-US_: RESISTOR, American symbol; SPICEPREFIX: R
R2-R7 = SparkFun-Resistors:10KOHM-1/10W-1%(0603): RES-00824; PROD_ID: RES-00824
R8 R9 = SparkFun-Resistors:10KOHM-1/10W-1%(0603): RES-00824; PROD_ID: RES-00824; VALUE: 10K
R10-R12 = openag-resistors:100OHM-RC0603JR-07100RL: Yageo - RC0603JR-07100RL - RES SMD 100 OHM 5% 1/10W 0603 Description: 100 Ohms ±5% 0.1W, 1/10W Chip Resistor 0603 (1608 Metric) Moisture Resistant Thick Film Technical Specifications: Resistance: 100 Ohms Tolerance: ±5% Power (Watts): 0.1W, 1/10W Composition: Thick Film Features: Moisture Resistant Temperature Coefficient: ±100ppm/°C Operating Temperature: -55°C ~ 155°C Package / Case: 0603 (1608 Metric) Supplier Device Package: 0603 Size / Dimension: 0.063" L x 0.032" W (1.60mm x 0.80mm) Height - Seated (Max): 0.022" (0.55mm) Number of Terminations: 2 Datasheet(s): Thick Film Chip Resistor Intro <http://www.yageo.com.tw/exep/pages/download/literatures/PYu-R_INT-thick_7.pdf> Chip Resistor Marking <http://www.yageo.com/exep/pages/download/literatures/PYu-R_Marking_2.pdf> RC Series, L Datasheet <http://www.yageo.com/documents/recent/PYu-RC_Group_51_RoHS_L_8.pdf> Vendor(s): Digikey: 311-100GRCT-ND <https://www.digikey.com/product-detail/en/yageo/RC0603JR-07100RL/311-100GRCT-ND/729644>; POPULATE: YES; VALUE: 100 OHM; VERIFIED: NO
T1 = R-78E5.0-1.0:R-78E5.0-1.0: Non-Isolated DC/DC Converters 8-28Vin 5V 1.0A THRU <https://componentsearchengine.com/Images/1/R-78E5.0-1.0.jpg> Source: Datasheet <http://www.recom-power.com/pdf/Innoline/R-78Exx-1.0.pdf>; DESCRIPTION: Non-Isolated DC/DC Converters 8-28Vin 5V 1.0A THRU; HEIGHT: mm; MANUFACTURER_NAME: RECOM Power; MANUFACTURER_PART_NUMBER: R-78E5.0-1.0; RS_PART_NUMBER: 1446290; SUPPLIER_NAME: RS
U1 = OpenAG_I2C:TCA9548APWR; MANUFACTURER_PART_NUMBER: TCA9548APWR; VENDOR: TEXAS INSTRUMENTS
U$1 U$3 = PJ-036ah:PJ-036AH
U$4 = openag-connectors:BBB_SMD

## Board
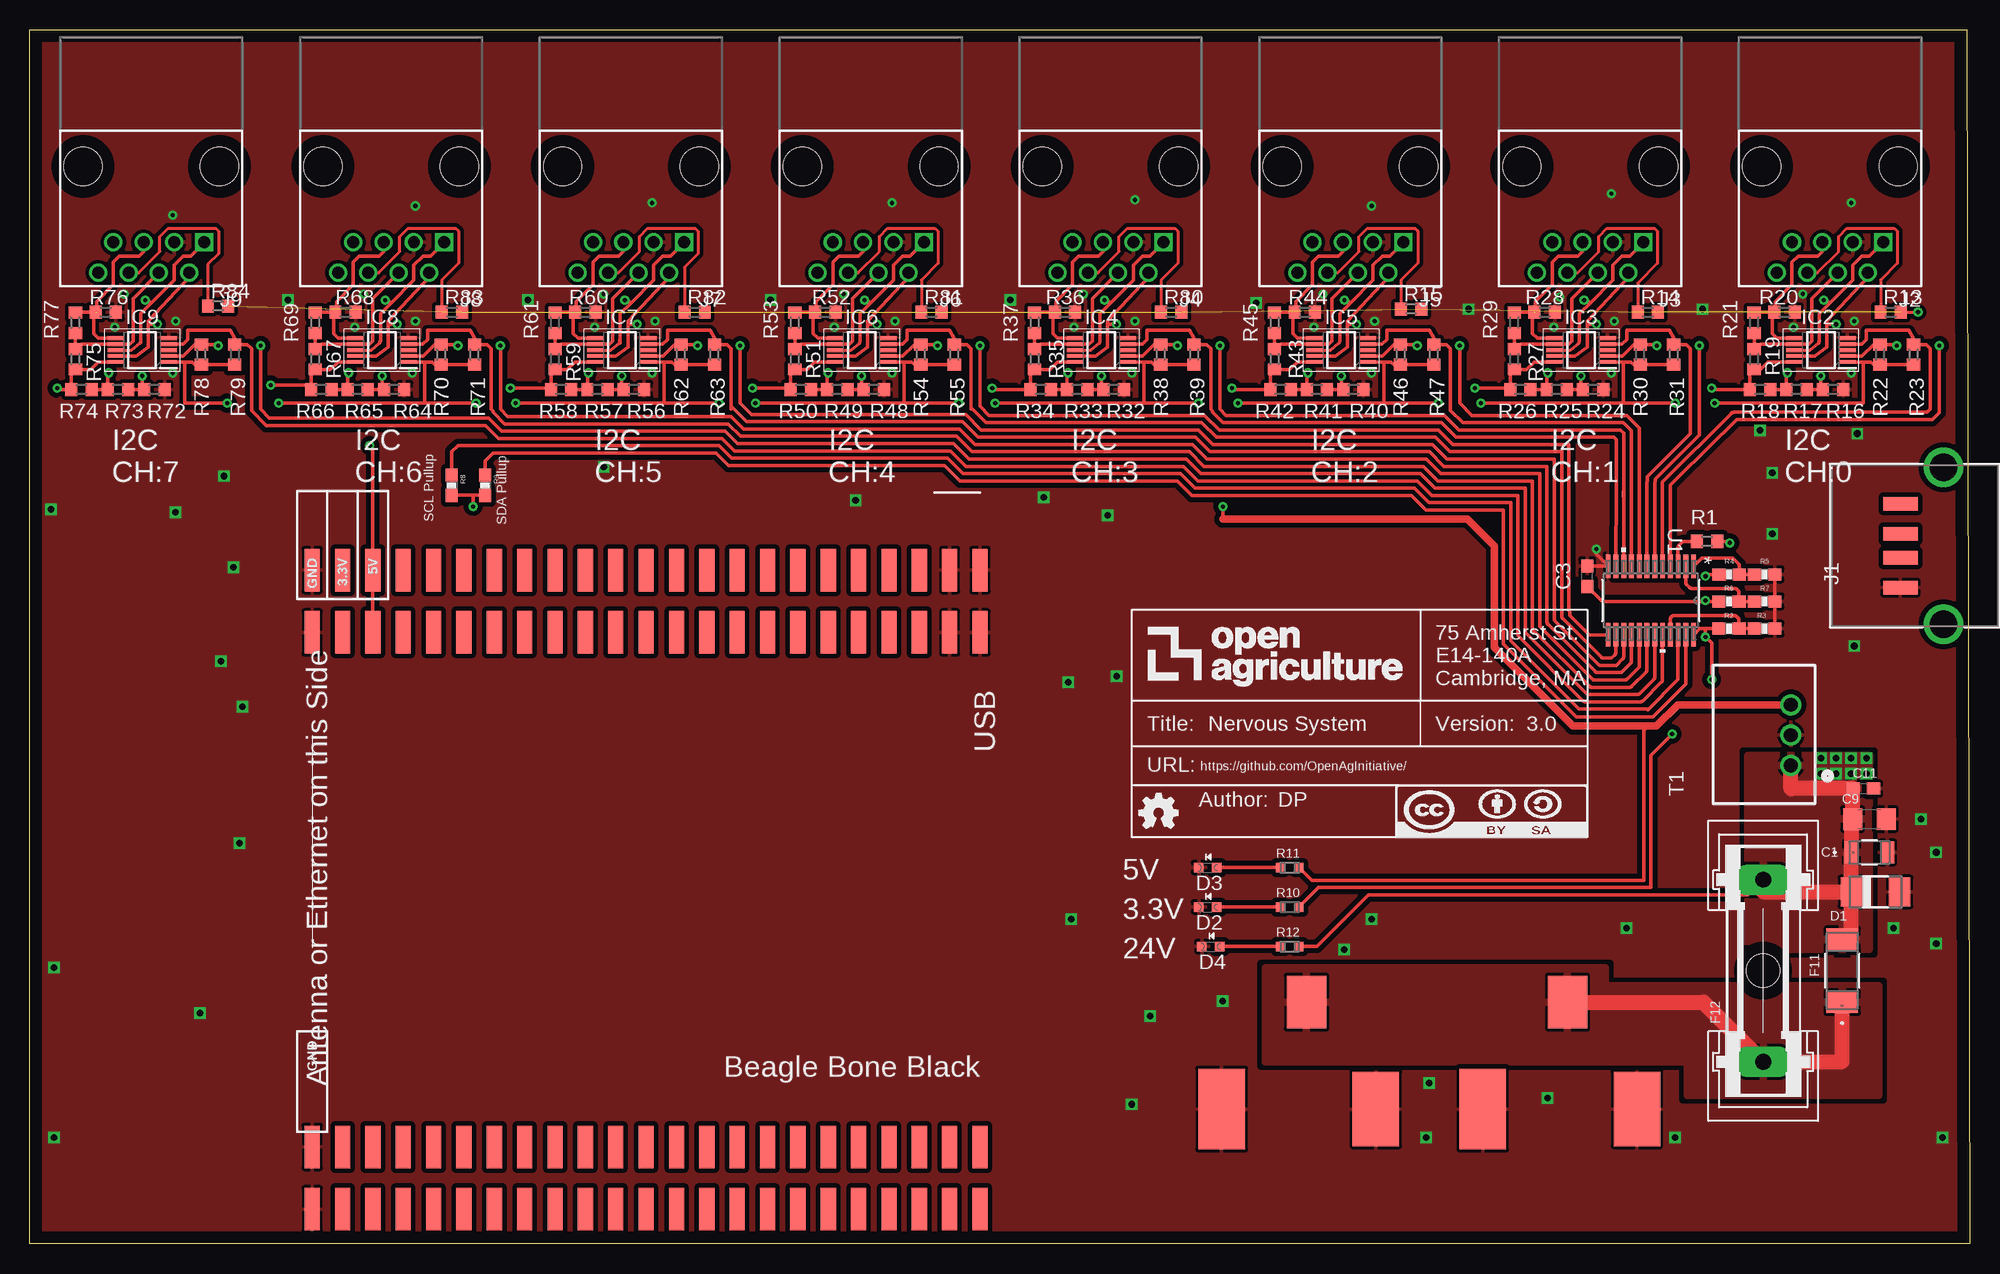
[diagram p5: board, top side]
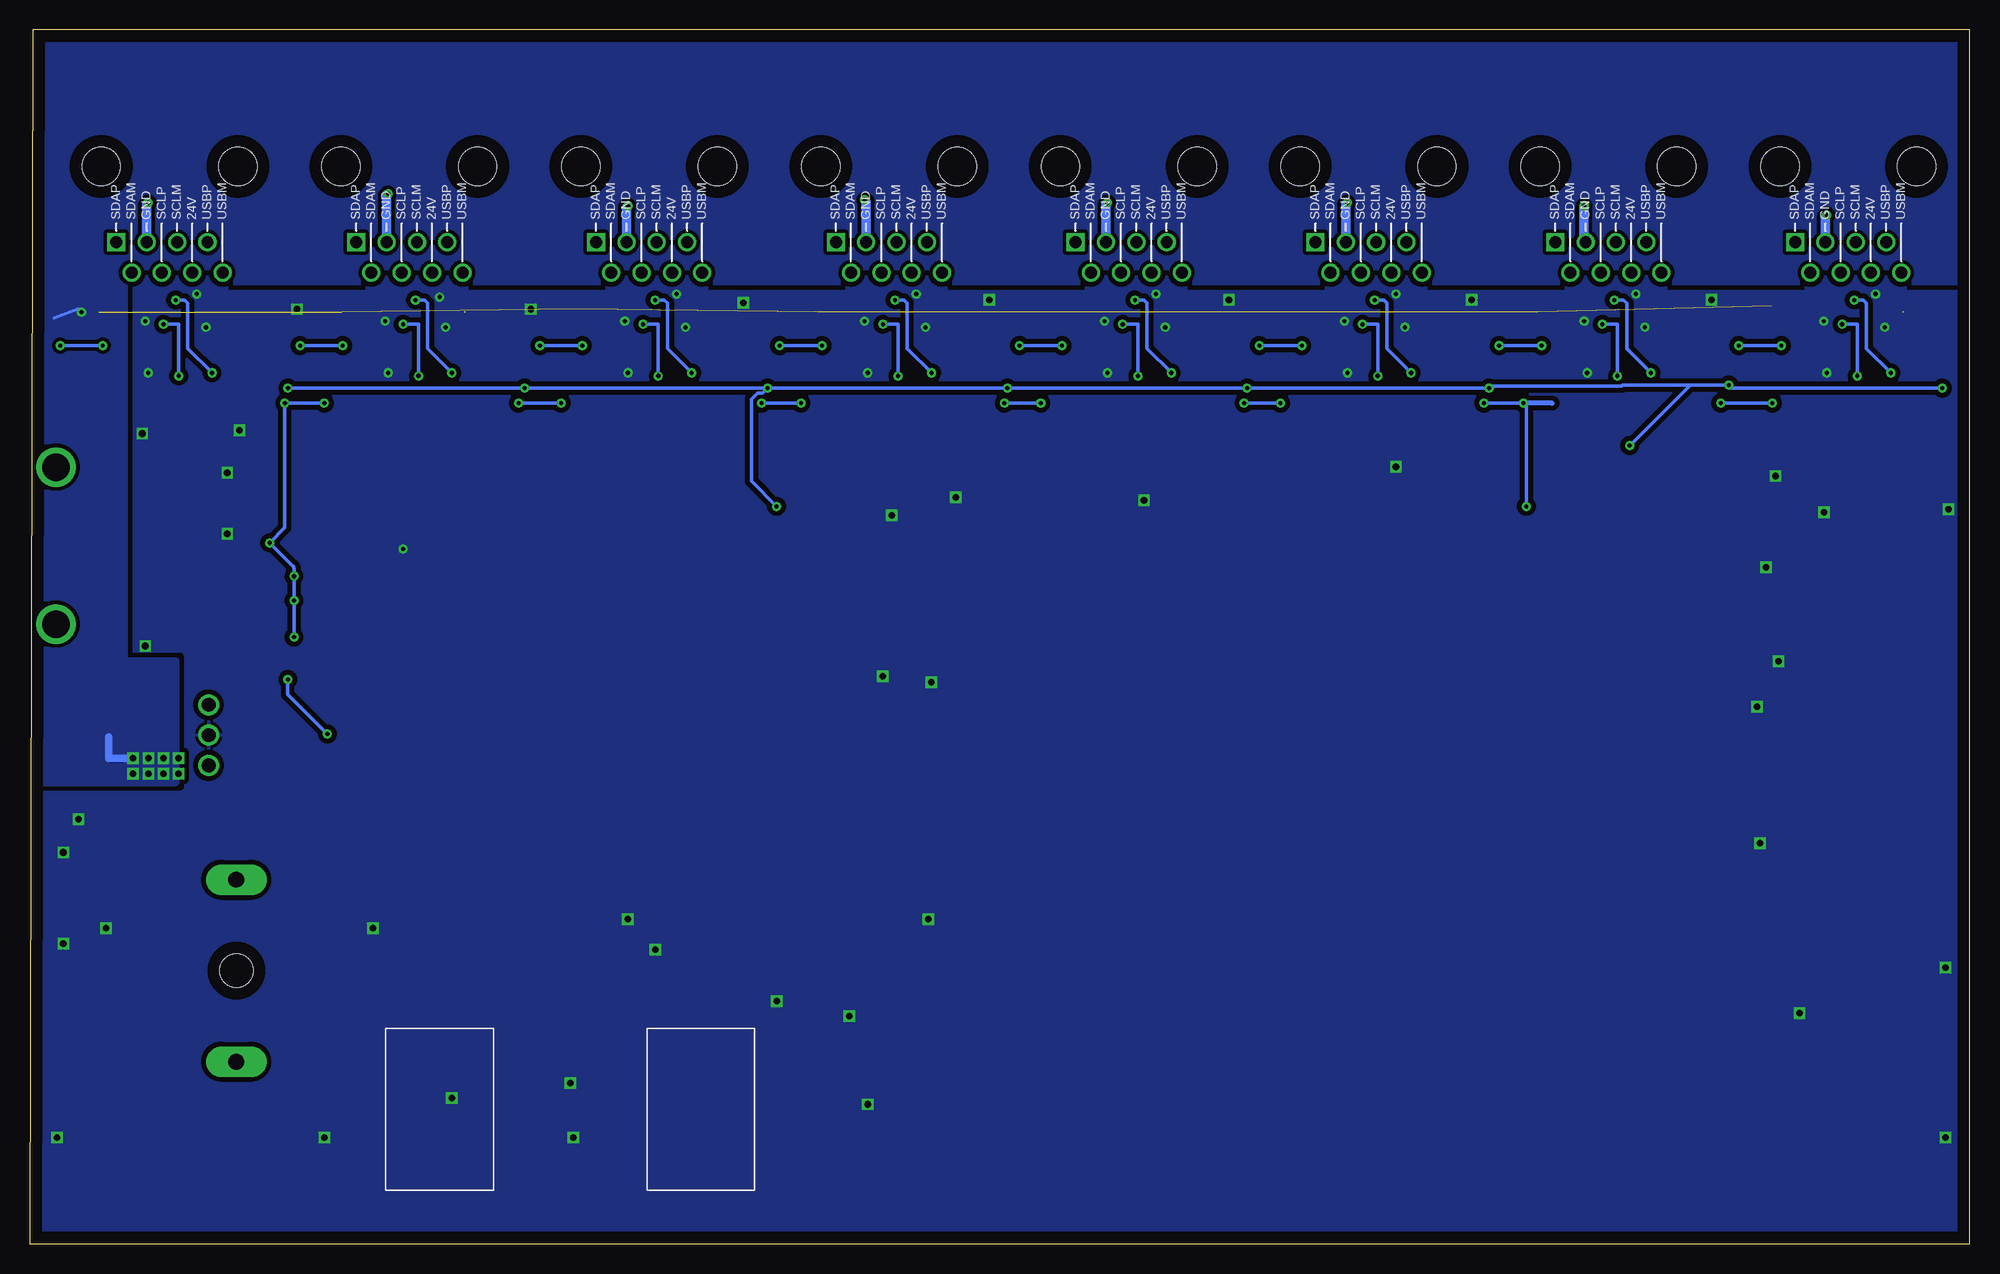
[diagram p6: board, bottom side, seen from below]

Size 162.31 x 101.6 mm. Coordinates in mm from the lower left corner, seen from the top.
Outline: 0,0 0,101.6 162.05,101.6 162.31,0 0,0
Copper layers (1*16): Top 0.035mm / dielectric 1.5mm / Bottom 0.035mm
Design rules "default *": minimum track width 6mil, minimum drill 0.35mm, track to track 12mil, track to pad 12mil, pad to pad 6mil, via to via 6mil, smd to smd 6mil, copper to edge 40mil, drill to drill 6mil, minimum pad ring 10mil, minimum via ring 8mil, stop-mask expansion 4mil, vias tented up to drill 25mil, thermal gap 10mil

### Footprints (pad centres in the part's own frame; a part is rotated, then mirrored left to right if it is on the bottom)
CAP_C1206 = smd 1.118 x 1.803: 1 -1.499,0; 2 1.499,0
C0603@1 = smd 1.1 x 1: 1 -0.85,0; 2 0.85,0
C1206 = smd 1.6 x 1.8: 1 -1.4,0; 2 1.4,0
DO-214AC = smd 1.8 x 2.4: A 2.025,0; C -2.025,0
CHIPLED_0603 = smd 0.8 x 0.8: A 0,-0.75; C 0,0.75
SS = smd 1.803 x 2.642: 1 -2.629,0; 2 2.629,0
GSH15 = drill 1.321 pad 2.54 long: 1 -7.62,0; 2 7.62,0 | hole 2.794: 0,0
SOP50P490X110-10N = smd 1.4 x 0.3: 1 -2.2,1; 2 -2.2,0.5; 3 -2.2,0; 4 -2.2,-0.5; 5 -2.2,-1; 6 2.2,-1; 7 2.2,-0.5; 8 2.2,0; 9 2.2,0.5; 10 2.2,1
CONN_USB-87583 = smd 1.12 x 2.88: 1 -3.492,1.221; 2 -0.992,1.221; 3 1.008,1.221; 4 3.508,1.221 | drill 2.311 pad 2.819: 6 -6.553,-2.388; 7 6.579,-2.388
OPENAG-V1-RJ45 = drill 1: 24V(6) 1.905,8.89; DSCLM(5) 0.635,6.35; DSCLP(4) -0.635,8.89; DSDAM(2) -3.175,8.89; GND(3) -1.905,6.35; USBM(8) 4.445,8.89; USBP(7) 3.175,6.35 | drill 1 square: DSDAP(1) -4.445,6.35 | hole 3.2: -5.715,0; 5.715,0
R0603 = smd 1 x 1.1: 1 -0.85,0; 2 0.85,0
0603-RES = smd 1.1 x 1: 1 -0.85,0; 2 0.85,0
RC0603N = smd 0.756 x 0.8: 1 -0.778,0; 2 0.778,0
R-78E5.0-1.0 = drill 1.15 pad 1.75: 1 3.21,2; 2 5.75,2; 3 8.29,2
PW24-M = smd 1.981 x 0.406: 1 -2.87,3.575; 2 -2.87,2.925; 3 -2.87,2.275; 4 -2.87,1.625; 5 -2.87,0.975; 6 -2.87,0.325; 7 -2.87,-0.325; 8 -2.87,-0.975; 9 -2.87,-1.625; 10 -2.87,-2.275; 11 -2.87,-2.925; 12 -2.87,-3.575; 13 2.87,-3.575; 14 2.87,-2.925; 15 2.87,-2.275; 16 2.87,-1.625; 17 2.87,-0.975; 18 2.87,-0.325; 19 2.87,0.325; 20 2.87,0.975; 21 2.87,1.625; 22 2.87,2.275; 23 2.87,2.925; 24 2.87,3.575
PJ-036AH = smd 4.4 x 3.3: 1 2.2,-0.65 | smd 6.75 x 3.9: 2 -6.75,6.45 | smd 6.2 x 3.9: 3 -6.75,-6.45
23PINHEADERSMD = smd 1.27 x 3.556: AIN0 7.62,0; AIN1 7.62,5.207; AIN2 10.16,0; AIN3 10.16,5.207; AIN4 15.24,0; AIN5 12.7,5.207; AIN6 12.7,0; DGND 55.88,0; DGND1 2.54,0; DGND2 0,0; DGND3 0,5.207; DGND4 2.54,5.207; DGND5 55.88,5.207; DGND6 55.88,48.26; DGND7 55.88,53.467; ECAPWMO 5.08,5.207; EHRPWM1A 40.64,5.207; EHRPWM1B 38.1,5.207; EHRPWM2A 33.02,48.26; EHRPWM2B 40.64,48.26; GND_ADC 15.24,5.207; GPIO_20 5.08,0; GPIO_26 40.64,53.467; GPIO_27 35.56,48.26; GPIO_44 43.18,53.467; GPIO_45 43.18,48.26; GPIO_46 38.1,53.467; GPIO_47 38.1,48.26; GPIO_48 38.1,0; GPIO_49 27.94,0; GPIO_60 43.18,5.207; GPIO_61 25.4,53.467; GPIO_65 35.56,53.467; GPIO_66 48.26,48.26; GPIO_67 48.26,53.467; GPIO_68 45.72,53.467; GPIO_69 45.72,48.26; GPIO_112 20.32,5.207; GPIO_115 22.86,0; GPIO_117 25.4,0; I2C2_SCL 33.02,0; I2C_SDA 33.02,5.207; LCD_AC_BIAS 20.32,53.467; LCD_DATA0 0,48.26; LCD_DATA1 0,53.467; LCD_DATA2 2.54,48.26; LCD_DATA3 2.54,53.467; LCD_DATA4 5.08,48.26; LCD_DATA5 5.08,53.467; LCD_DATA6 7.62,48.26; LCD_DATA7 7.62,53.467; LCD_DATA8 10.16,48.26; LCD_DATA9 10.16,53.467; LCD_DATA10 12.7,53.467; LCD_DATA11 15.24,53.467; LCD_DATA12 12.7,48.26; LCD_DATA13 15.24,48.26; LCD_DATA14 17.78,48.26; LCD_DATA15 17.78,53.467; LCD_HSYNC 20.32,48.26; LCD_PCLK 22.86,53.467; LCD_VSYNC 22.86,48.26; MMC1_CLK 30.48,48.26; MMC1_CMD 33.02,53.467; MMC1_DAT0 25.4,48.26; MMC1_DAT1 27.94,53.467; MMC1_DAT2 50.8,48.26; MMC1_DAT3 50.8,53.467; MMC1_DAT4 27.94,48.26; MMC1_DAT5 30.48,53.467; MMC1_DAT6 53.34,48.26; MMC1_DAT7 53.34,53.467; PWR_BUT 45.72,0; SP11_CS0 22.86,5.207; SP11_DO 20.32,0; SP11_SCLK 17.78,0; SPIO_CS0 35.56,0; SPIO_D1 35.56,5.207; SPIO_DO 30.48,0; SPIO_SLCK 30.48,5.207; SYS5V 48.26,0; SYS5V1 48.26,5.207; SYS_RESET 45.72,5.207; UART1_RXD 25.4,5.207; UART1_TXD 27.94,5.207; UART4_RXD 43.18,0; UART4_TXD 40.64,0; VDD3.3 53.34,5.207; VDD3.31 53.34,0; VDD5V 50.8,0; VDD5V1 50.8,5.207; VDD_ADC 17.78,5.207

### Placement (x,y rotation side)
ATTRIBUTES  92.2,34.04 0 top
C1  153.92,32.77 0 top
C3  130.3,55.88 90 top
C9  153.92,35.56 0 top
C11  153.42,38.1 0 top
D1  154.43,29.46 0 top
D2  98.55,28.19 90 top
D3  98.55,31.5 90 top
D4  98.81,24.89 90 top
F11  151.64,22.86 90 top
F12  145.03,22.86 90 top
IC2  149.86,74.8 180 top
IC3  129.79,74.8 180 top
IC4  89.66,74.8 180 top
IC5  109.73,74.8 180 top
IC6  69.6,74.8 180 top
IC7  49.53,74.8 180 top
IC8  29.46,74.8 180 top
IC9  9.4,74.8 180 top
J1  157.73,58.42 90 top
J2  150.62,90.17 180 top
J3  130.56,90.17 180 top
J4  90.42,90.17 180 top
J5  110.49,90.17 180 top
J6  70.36,90.17 180 top
J7  50.29,90.17 180 top
J8  30.23,90.17 180 top
J9  10.16,90.17 180 top
R1  140.34,58.8 0 top
R2  142.16,51.49 180 top
R3  145.16,51.49 180 top
R4  142.19,56.03 180 top
R5  145.16,56.03 180 top
R6  142.16,53.77 180 top
R7  145.16,53.77 180 top
R8  35.31,63.5 270 top
R9  38.1,63.5 270 top
R10  105.41,28.19 0 top
R11  105.41,31.5 0 top
R12  105.41,24.89 0 top
R13  155.7,77.98 0 top
R14  135.38,77.98 0 top
R15  115.57,78.23 0 top
R16  150.88,71.5 0 top
R17  147.83,71.5 0 top
R18  144.78,71.5 0 top
R19  144.27,74.04 270 top
R20  146.81,77.98 180 top
R21  144.27,77.09 270 top
R22  154.81,74.42 270 top
R23  157.61,74.42 270 top
R24  130.81,71.5 0 top
R25  127.76,71.5 0 top
R26  124.71,71.5 0 top
R27  124.21,74.04 270 top
R28  126.75,77.98 180 top
R29  124.21,77.09 270 top
R30  134.75,74.42 270 top
R31  137.54,74.42 270 top
R32  90.68,71.5 0 top
R33  87.63,71.5 0 top
R34  84.58,71.5 0 top
R35  84.07,74.04 270 top
R36  86.61,77.98 180 top
R37  84.07,77.09 270 top
R38  94.61,74.42 270 top
R39  97.41,74.42 270 top
R40  110.74,71.5 0 top
R41  107.7,71.5 0 top
R42  104.65,71.5 0 top
R43  104.14,74.04 270 top
R44  106.68,77.98 180 top
R45  104.14,77.09 270 top
R46  114.68,74.42 270 top
R47  117.47,74.42 270 top
R48  70.61,71.5 0 top
R49  67.56,71.5 0 top
R50  64.52,71.5 0 top
R51  64.01,74.04 270 top
R52  66.55,77.98 180 top
R53  64.01,77.09 270 top
R54  74.55,74.42 270 top
R55  77.34,74.42 270 top
R56  50.55,71.5 0 top
R57  47.5,71.5 0 top
R58  44.45,71.5 0 top
R59  43.94,74.04 270 top
R60  46.48,77.98 180 top
R61  43.94,77.09 270 top
R62  54.48,74.42 270 top
R63  57.28,74.42 270 top
R64  30.48,71.5 0 top
R65  27.43,71.5 0 top
R66  24.38,71.5 0 top
R67  23.88,74.04 270 top
R68  26.42,77.98 180 top
R69  23.88,77.09 270 top
R70  34.42,74.42 270 top
R71  37.21,74.42 270 top
R72  10.41,71.5 0 top
R73  7.37,71.5 0 top
R74  4.32,71.5 0 top
R75  3.81,74.04 270 top
R76  6.35,77.98 180 top
R77  3.81,77.09 270 top
R78  14.35,74.42 270 top
R79  17.14,74.42 270 top
R80  95.5,77.98 0 top
R81  75.44,77.98 0 top
R82  55.63,77.98 0 top
R83  35.31,77.98 0 top
R84  15.75,78.49 0 top
T1  149.35,36.83 90 top
U1  135.64,53.85 270 top
U$1  128.02,18.03 90 top
U$3  106.17,18.03 90 top
U$4  79.5,56.39 180 top

### Tracks (layer width: path | path; a pad name or v marks a point on that pad's centre or on a via)
24V_IN
  Top 1.27: F11.1 151.64,15.24 F12.1 140.04,20.23 U$1.1
  pour Top (isolate 0.406): 103.38,23.11 103.38,15.24 138.68,15.24 138.68,12.45 154.69,12.45 154.69,21.59 131.83,21.59 131.83,23.11
+3V3  (via drill 0.35)
  Top 0.305: U1.24 139.72,51.49 140.21,51.49 | 140.21,51.49 R2.2 | R6.2 140.28,53.77 | 140.28,53.77 v140.21,53.85 | 140.21,51.49 v140.21,50.8 140.72,50.29 v140.72,47.24 | R4.2 140.36,56.03 v140.21,55.88 | R1.2 142.11,58.8 v142.24,58.67 | C3.1 131.56,53.77 140.28,53.77 | IC2.1 153.42,73.8 | 153.42,73.8 154.03,73.8 154.27,73.57 R22.2 R23.2 | 153.42,73.8 153.42,70.36 v140.97,70.36 | IC3.1 133.35,73.8 | 133.35,73.8 133.97,73.8 134.2,73.57 R30.2 R31.2 | 133.35,70.36 133.35,73.8 | IC5.1 113.28,73.8 | 113.28,73.8 113.9,73.8 114.13,73.57 R46.2 R47.2 | 113.28,70.36 113.28,73.8 | IC4.1 93.22,73.8 | 93.22,73.8 93.84,73.8 94.07,73.57 R38.2 R39.2 | 93.22,70.36 93.22,73.8 | IC6.1 73.15,73.8 | 73.15,73.8 73.77,73.8 74,73.57 R54.2 R55.2 | 73.15,70.36 73.15,73.8 | IC7.1 53.09,73.8 | 53.09,73.8 53.7,73.8 53.94,73.57 R62.2 R63.2 | 53.09,70.36 53.09,73.8 | IC8.1 33.02,73.8 | 33.02,73.8 33.64,73.8 33.87,73.57 R70.2 R71.2 | 33.02,70.36 33.02,73.8 | IC9.1 12.95,73.8 | 12.95,73.8 13.57,73.8 13.8,73.57 R78.2 R79.2 | 12.95,73.8 12.95,70.36 v16.51,70.36 | v20.83,70.36 33.02,70.36 | 33.02,70.36 v37.34,70.36 | v40.64,70.36 53.09,70.36 | 53.09,70.36 v57.66,70.36 | v60.71,70.36 73.15,70.36 | 73.15,70.36 v77.72,70.36 | v80.77,70.36 93.22,70.36 | 93.22,70.36 v97.79,70.36 | v101.09,70.36 113.28,70.36 | 113.28,70.36 v117.86,70.36 | v121.41,70.36 133.35,70.36 | 133.35,70.36 v137.67,70.36 | R10.2 107.81,29.82 135.64,29.82 135.64,40.89 v137.41,42.67 | R8.2 37.08,62.65 | 37.08,62.65 R9.2 | v37.08,61.72 37.08,62.65
  Bottom 0.305: v140.21,50.8 v140.21,53.85 v140.21,55.88 140.21,56.51 arc-45 140.3,56.73 v142.24,58.67 140.97,59.94 v140.97,70.36 v137.67,70.36 | v16.51,70.36 v20.83,70.36 | v40.64,70.36 v37.34,70.36 37.08,70.1 v37.08,61.72 | v57.66,70.36 v60.71,70.36 | v77.72,70.36 v80.77,70.36 | v97.79,70.36 v101.09,70.36 | v117.86,70.36 v121.41,70.36 | v137.41,42.67 140.72,45.97 v140.72,47.24
  Bottom 0.406: 34.92,70.36 v37.34,70.36
+5V  (via drill 0.35)
  Top 0.305: IC2.10 145.43,73.8 144.78,73.15 144.31,73.15 | 144.31,73.15 R19.2 | 144.31,73.15 143.93,72.77 R18.1 140.84,71.5 v140.72,71.63 | IC3.10 125.87,73.8 125.22,73.15 124.25,73.15 | 124.25,73.15 R27.2 | 124.25,73.15 123.86,72.77 R26.1 123.74,71.63 v120.9,71.63 | IC5.10 106.06,73.8 105.41,73.15 104.18,73.15 | 104.18,73.15 R43.2 | 104.18,73.15 103.8,72.77 R42.1 100.71,71.5 v100.58,71.63 | IC4.10 86,73.8 85.34,73.15 84.11,73.15 | 84.11,73.15 R35.2 | 84.11,73.15 83.73,72.77 R34.1 80.64,71.5 v80.52,71.63 | IC6.10 65.67,73.8 65.02,73.15 64.05,73.15 | 64.05,73.15 R51.2 | 64.05,73.15 63.67,72.77 R50.1 63.54,71.63 v60.45,71.63 | IC7.10 45.61,73.8 44.96,73.15 43.98,73.15 | 43.98,73.15 R59.2 | R58.1 43.6,71.63 | 43.6,71.63 43.6,72.77 43.98,73.15 | IC8.10 25.8,73.8 25.15,73.15 23.91,73.15 | 23.91,73.15 R67.2 | 23.91,73.15 23.53,72.77 R66.1 23.15,71.88 v20.14,71.88 | IC9.10 5.73,73.8 5.08,73.15 3.85,73.15 | 3.85,73.15 R75.2 | 3.85,73.15 3.47,72.77 R74.1 2.41,71.5 v2.29,71.63 | v40.2,71.63 43.6,71.63 | v99.82,61.72 99.82,60.66 | R11.2 107.25,30.43 135.03,30.43 135.03,42.98 135.38,43.33 | U$4.VDD5V1 U$4.VDD5V 28.7,66.55 v28.45,66.8
  Top 0.61: 99.82,60.66 120.29,60.66 122.53,58.42 122.53,49.91 129.1,43.33 135.38,43.33 136.1,43.33 137.89,45.12 T1.3
  Bottom 0.305: v2.29,71.63 19.89,71.63 v20.14,71.88 | v20.14,71.88 29.05,71.88 29.12,71.81 40.02,71.81 v40.2,71.63 v60.45,71.63 v80.52,71.63 v100.58,71.63 | v100.58,71.63 v120.9,71.63 v140.72,71.63 | v100.58,71.63 101.02,71.19 101.44,71.19 101.93,70.7 101.93,63.83 v99.82,61.72 | v28.45,66.8 23.37,71.88 v20.14,71.88
+24V  (via drill 0.35, 0.55)  (7 unrouted)
  Top 0.254: R13.2 v157.99,77.98
  Top 0.305: R12.2 107.7,24.89 112.01,29.21 143.76,29.21 F12.2
  Top 1.27: F12.2 145.03,29.46 D1.C | F11.2 152.41,25.49 D1.C | D1.C 152.41,32.77 C1.1 152.43,35.56 C9.1 152.52,38.1 C11.1 147.35,38.1 T1.1
  Bottom 0.254: v157.99,77.98 158.24,78.23 160.27,77.47
  Bottom 0.61: v153.67,40.64 155.7,40.64 155.7,42.42
  other vias: 152.4,40.64 151.13,40.64 149.86,40.64 153.67,39.37 152.4,39.37 151.13,39.37 149.86,39.37
  pour Top (isolate 0.406): 153.92,24.64 153.92,40.89 143.76,40.89 143.76,24.64
  pour Bottom (isolate 0.254): 161.8,38.61 150.11,38.61 150.11,48.77 154.43,48.77 154.43,80.52 0.76,80.52 1.27,102.11 162.05,102.11 161.54,40.39
A0_EXT_1
  Top 0.305: R5.2 R4.1 143.04,56.73 arc45 142.95,56.95 142.59,57.31 arc45 142.36,57.4 139.9,57.4 U1.1
A1_EXT_1
  Top 0.305: R7.2 R6.1 143.01,54.47 arc45 142.92,54.69 142.84,54.77 arc45 142.62,54.86 139.07,54.86 arc-45 138.84,54.96 138.65,55.15 arc-45 138.56,55.37 U1.2
A2_EXT_1
  Top 0.305: R3.2 R2.1 143.01,52.18 arc45 142.92,52.41 142.84,52.48 arc45 142.62,52.58 137.58,52.58 arc90 137.26,52.26 U1.21
DSCLM0
  Top 0.305: R21.1 144.31,77.98 145.8,77.98 | IC2.6 146.19,75.8 145.8,76.2 145.8,77.98 | J2.DSCLM(5) 149.99,83.06 149.61,82.68 147.96,82.68 147.45,82.17 147.45,80.26 146.05,78.87 146.05,77.98 R20.2 145.8,77.98
DSCLM1  (1 unrouted)
  Top 0.305: R29.1 124.25,77.98 125.73,77.98 | 125.73,77.98 R28.2 | IC3.6 126.13,75.8 125.73,76.2 125.73,77.98 | 125.98,77.98 125.98,78.87 127.38,80.26 127.38,82.17 127.89,82.68 129.54,82.68 129.92,83.06 J3.DSCLM(5)
DSCLM2
  Top 0.305: R45.1 104.18,77.98 105.66,77.98 | 105.66,77.98 R44.2 105.92,77.98 105.92,78.87 107.31,80.26 107.31,82.17 107.82,82.68 109.47,82.68 109.86,83.06 J5.DSCLM(5) | IC5.6 106.06,75.8 105.66,76.2 105.66,77.98
DSCLM3  (1 unrouted)
  Top 0.305: R37.1 84.11,77.98 85.6,77.98 | 85.6,77.98 R36.2 | IC4.6 86,75.8 85.6,76.2 85.6,77.98 | 85.85,77.98 85.85,78.87 87.25,80.26 87.25,82.17 87.76,82.68 89.41,82.68 89.79,83.06 J4.DSCLM(5)
DSCLM4
  Top 0.305: R53.1 64.05,77.98 65.53,77.98 | IC6.6 65.93,75.8 65.53,76.2 65.53,77.98 | J6.DSCLM(5) 69.72,83.06 69.34,82.68 67.69,82.68 67.18,82.17 67.18,80.26 65.79,78.87 65.79,77.98 R52.2 65.53,77.98
DSCLM5  (1 unrouted)
  Top 0.305: R61.1 43.98,77.98 45.47,77.98 | 45.47,77.98 R60.2 | IC7.6 45.86,75.8 45.47,76.2 45.47,77.98 | 45.72,77.98 45.72,78.87 47.12,80.26 47.12,82.17 47.62,82.68 49.28,82.68 49.66,83.06 J7.DSCLM(5)
DSCLM6
  Top 0.305: R69.1 23.91,77.98 25.4,77.98 | 25.4,77.98 R68.2 25.65,77.98 25.65,78.87 27.05,80.26 27.05,82.17 27.56,82.68 29.21,82.68 29.59,83.06 J8.DSCLM(5) | IC8.6 25.8,75.8 25.4,76.2 25.4,77.98
DSCLM7  (1 unrouted)
  Top 0.305: R77.1 3.85,77.98 5.33,77.98 | 5.33,77.98 R76.2 | IC9.6 5.73,75.8 5.33,76.2 5.33,77.98 | 5.59,77.98 5.59,78.87 6.99,80.26 6.99,82.17 7.49,82.68 9.14,82.68 9.53,83.06 J9.DSCLM(5)
DSCLP0
  Top 0.305: R21.2 R19.1 144.82,75.31 145.29,75.31 145.42,75.3 IC2.7 148.84,75.3 149.1,75.56 149.1,79.12 J2.DSCLP(4)
DSCLP1
  Top 0.305: R29.2 R27.1 124.75,75.31 125.22,75.31 125.36,75.3 IC3.7 128.77,75.3 129.03,75.56 129.03,79.12 J3.DSCLP(4)
DSCLP2
  Top 0.305: R45.2 R43.1 104.69,75.31 105.16,75.31 105.29,75.3 IC5.7 108.7,75.3 108.97,75.56 108.97,79.12 J5.DSCLP(4)
DSCLP3
  Top 0.305: R37.2 R35.1 84.62,75.31 85.09,75.31 85.22,75.3 IC4.7 88.64,75.3 88.9,75.56 88.9,79.12 J4.DSCLP(4)
DSCLP4
  Top 0.305: R53.2 R51.1 64.56,75.31 65.02,75.31 65.16,75.3 IC6.7 68.57,75.3 68.83,75.56 68.83,79.12 J6.DSCLP(4)
DSCLP5
  Top 0.305: R61.2 R59.1 44.49,75.31 44.96,75.31 45.09,75.3 IC7.7 48.51,75.3 48.77,75.56 48.77,79.12 J7.DSCLP(4)
DSCLP6
  Top 0.305: R69.2 R67.1 24.42,75.31 24.89,75.31 25.03,75.3 IC8.7 28.44,75.3 28.7,75.56 28.7,79.12 J8.DSCLP(4)
DSCLP7
  Top 0.305: R77.2 R75.1 4.36,75.31 4.83,75.31 4.96,75.3 IC9.7 8.37,75.3 8.64,75.56 8.64,79.12 J9.DSCLP(4)
DSDAM0  (via drill 0.35)
  Top 0.305: J2.DSDAM(2) 153.8,80.9 150.37,77.22 150.37,76.96 | IC2.9 149.35,74.3 150.37,75.06 150.37,76.96 | R17.2 R16.1 arc-90 149.86,71.67 v149.86,72.64 149.86,72.77 | v151.13,76.96 150.37,76.96
  Bottom 0.305: v149.86,72.64 149.86,76.96 v151.13,76.96
DSDAM1  (via drill 0.35)
  Top 0.305: J3.DSDAM(2) 133.73,80.9 130.3,77.22 130.3,76.96 | IC3.9 127.6,74.3 129.29,74.3 130.3,75.06 130.3,76.96 | R25.2 R24.1 arc-90 129.79,71.67 v129.79,72.64 129.79,72.77 | v131.06,76.96 130.3,76.96
  Bottom 0.305: v129.79,72.64 129.79,76.96 v131.06,76.96
DSDAM2  (via drill 0.35)
  Top 0.305: J5.DSDAM(2) 113.67,80.9 110.24,77.22 110.24,76.96 | IC5.9 109.22,74.3 110.24,75.06 110.24,76.96 | R41.2 R40.1 arc-90 109.73,71.67 v109.73,72.64 109.73,72.77 | v111,76.96 110.24,76.96
  Bottom 0.305: v109.73,72.64 109.73,76.96 v111,76.96
DSDAM3  (via drill 0.35)
  Top 0.305: J4.DSDAM(2) 93.6,80.9 90.17,77.22 90.17,76.96 | IC4.9 89.15,74.3 90.17,75.06 90.17,76.96 | R33.2 R32.1 arc-90 89.66,71.67 v89.66,72.64 89.66,72.77 | v90.93,76.96 90.17,76.96
  Bottom 0.305: v89.66,72.64 89.66,76.96 v90.93,76.96
DSDAM4  (via drill 0.35)
  Top 0.305: J6.DSDAM(2) 73.53,80.9 70.1,77.22 70.1,76.96 | IC6.9 69.09,74.3 70.1,75.06 70.1,76.96 | R49.2 R48.1 arc-90 69.6,71.67 v69.6,72.64 69.6,72.77 | v70.87,76.96 70.1,76.96
  Bottom 0.305: v69.6,72.64 69.6,76.96 v70.87,76.96
DSDAM5  (via drill 0.35)
  Top 0.305: J7.DSDAM(2) 53.47,80.9 50.04,77.22 50.04,76.96 | IC7.9 49.02,74.3 50.04,75.06 50.04,76.96 | R57.2 R56.1 arc-90 49.53,71.67 v49.53,72.64 49.53,72.77 | v50.8,76.96 50.04,76.96
  Bottom 0.305: v49.53,72.64 49.53,76.96 v50.8,76.96
DSDAM6  (via drill 0.35)
  Top 0.305: J8.DSDAM(2) 33.4,80.9 29.97,77.22 29.97,76.96 | IC8.9 27.27,74.3 28.96,74.3 29.97,75.06 29.97,76.96 | R65.2 R64.1 arc-90 29.46,71.67 v29.46,72.64 29.46,72.77 | v30.73,76.96 29.97,76.96
  Bottom 0.305: v29.46,72.64 29.46,76.96 v30.73,76.96
DSDAM7  (via drill 0.35)
  Top 0.305: J9.DSDAM(2) 13.34,80.9 9.91,77.22 9.91,76.96 | IC9.9 8.89,74.3 9.91,75.06 9.91,76.96 | R73.2 R72.1 arc-90 9.4,71.67 v9.4,72.64 9.4,72.77 | v10.67,76.96 9.91,76.96
  Bottom 0.305: v9.4,72.64 9.4,76.96 v10.67,76.96
DSDAP0  (via drill 0.35)
  Top 0.254: IC2.8 148.98,74.8 149.68,75.38
  Top 0.305: R18.2 R17.1 146.98,72.81 v147.07,72.9 | 149.68,75.39 149.73,75.56 | 149.73,75.56 149.73,77.85 150.62,78.74 | 150.62,78.74 152.53,80.64 152.53,81.92 153.29,82.68 153.92,82.68 J2.DSDAP(1) | v150.11,78.99 150.37,78.99 150.62,78.74 | 149.68,75.38 149.68,75.51 149.73,75.56
  Bottom 0.305: v147.07,72.9 149.1,74.93 149.1,78.74 149.35,78.99 v150.11,78.99
DSDAP1  (via drill 0.35)
  Top 0.254: IC3.8 128.92,74.8 129.62,75.38
  Top 0.305: R26.2 R25.1 126.91,72.81 v127,72.9 | 130.56,78.74 129.67,77.85 129.67,75.56 129.62,75.39 129.62,75.38 | 130.56,78.74 132.46,80.64 132.46,81.92 133.22,82.68 133.86,82.68 J3.DSDAP(1) | v130.05,78.99 130.3,78.99 130.56,78.74
  Bottom 0.305: v127,72.9 129.03,74.93 129.03,78.74 129.29,78.99 v130.05,78.99
DSDAP2  (via drill 0.35)
  Top 0.254: IC5.8 108.85,74.8 109.55,75.38
  Top 0.305: R42.2 R41.1 106.85,72.81 v106.93,72.9 | 110.49,78.74 109.6,77.85 109.6,75.56 109.55,75.39 109.55,75.38 | 110.49,78.74 112.39,80.64 112.39,81.92 113.16,82.68 113.79,82.68 J5.DSDAP(1) | v109.98,78.99 110.24,78.99 110.49,78.74
  Bottom 0.305: v106.93,72.9 108.97,74.93 108.97,78.74 109.22,78.99 v109.98,78.99
DSDAP3  (via drill 0.35)
  Top 0.254: IC4.8 88.78,74.8 89.48,75.38
  Top 0.305: R34.2 R33.1 86.78,72.81 v86.87,72.9 | 90.42,78.74 89.53,77.85 89.53,75.56 89.48,75.39 89.48,75.38 | 90.42,78.74 92.33,80.64 92.33,81.92 93.09,82.68 93.73,82.68 J4.DSDAP(1) | v89.92,78.99 90.17,78.99 90.42,78.74
  Bottom 0.305: v86.87,72.9 88.9,74.93 88.9,78.74 89.15,78.99 v89.92,78.99
DSDAP4  (via drill 0.35)
  Top 0.254: IC6.8 68.72,74.8 69.42,75.38
  Top 0.305: R50.2 R49.1 66.71,72.81 v66.8,72.9 | 70.36,78.74 69.47,77.85 69.47,75.56 69.42,75.39 69.42,75.38 | 70.36,78.74 72.26,80.64 72.26,81.92 73.03,82.68 73.66,82.68 J6.DSDAP(1) | v69.85,78.99 70.1,78.99 70.36,78.74
  Bottom 0.305: v66.8,72.9 68.83,74.93 68.83,78.74 69.09,78.99 v69.85,78.99
DSDAP5  (via drill 0.35)
  Top 0.254: IC7.8 48.65,74.8 49.35,75.38
  Top 0.305: R58.2 R57.1 46.65,72.81 v46.74,72.9 | 50.29,78.74 49.4,77.85 49.4,75.69 | 50.29,78.74 52.2,80.64 52.2,81.92 52.96,82.68 53.59,82.68 J7.DSDAP(1) | v49.78,78.99 50.04,78.99 50.29,78.74 | 49.38,75.38 49.38,75.41 49.4,75.44 49.4,75.69 | 49.35,75.38 49.35,75.64 49.4,75.69
  Bottom 0.305: v46.74,72.9 48.77,74.93 48.77,78.74 49.02,78.99 v49.78,78.99
DSDAP6  (via drill 0.35)
  Top 0.254: IC8.8 28.59,74.8 29.29,75.38
  Top 0.305: R66.2 R65.1 26.58,72.81 v26.67,72.9 | 29.29,75.39 29.34,75.56 | 29.34,75.56 29.34,77.85 30.23,78.74 | 30.23,78.74 32.13,80.64 32.13,81.92 32.89,82.68 33.53,82.68 J8.DSDAP(1) | v29.72,78.99 29.97,78.99 30.23,78.74 | 29.29,75.38 29.29,75.51 29.34,75.56
  Bottom 0.305: v26.67,72.9 28.7,74.93 28.7,78.74 28.96,78.99 v29.72,78.99
DSDAP7  (via drill 0.35)
  Top 0.254: IC9.8 8.52,74.8 9.22,75.38
  Top 0.305: R74.2 R73.1 6.52,72.81 v6.6,72.9 | 9.27,75.56 9.22,75.39 9.27,75.44 | 10.16,78.74 9.27,77.85 9.27,75.56 | 10.16,78.74 12.06,80.64 12.06,81.92 12.83,82.68 13.46,82.68 J9.DSDAP(1) | v9.65,78.99 9.91,78.99 10.16,78.74 | 9.27,75.44 9.27,75.56 | 9.22,75.38 9.27,75.43 9.27,75.44
  Bottom 0.305: v6.6,72.9 8.64,74.93 8.64,78.74 8.89,78.99 v9.65,78.99
GND  (via drill 0.35, 0.55)
  Top 0.305: C3.2 U1.12 131.06,57.72 v131.06,58.17 | R5.1 R7.1 R3.1
  Top 0.813: J9.GND(3) 12.06,84.17 | J7.GND(3) 52.2,84.17
  Bottom 0.813: J9.GND(3) 12.06,85.98 v11.94,86.11 | J8.GND(3) 32.26,83.95 v32.26,86.87 | J7.GND(3) 52.2,87 v52.07,87.12 | J6.GND(3) 72.26,87 v72.14,87.12 | J4.GND(3) 92.33,87.25 v92.46,87.38 | J5.GND(3) 112.39,86.74 v112.27,86.87 | J3.GND(3) 132.46,87.76 v132.33,87.88 | J2.GND(3) 152.53,87 v152.4,87.12
  other vias: 152.65,77.22 152.4,72.9 147.57,76.71 148.34,79.5 132.59,77.22 132.33,72.9 127.51,76.71 128.02,79.25 112.52,77.22 112.27,72.9 107.44,76.71 108.2,79.5 92.46,77.22 92.2,72.9 87.38,76.71 88.14,79.5 72.39,77.22 72.14,72.9 67.31,76.71 68.07,79.5 52.32,77.22 52.07,72.9 47.24,76.71 48.01,79.5 32.26,77.22 32,72.9 27.18,76.71 27.94,79.5 12.19,77.22 11.94,72.9 7.11,76.71 7.87,79.5 158.24,35.56 159.51,32.77 155.96,26.42 159.51,25.15 137.67,8.89 127,12.19 152.65,50.04 144.78,68.07 152.91,67.82 120.4,78.23 139.95,78.23 102.62,78.74 82.04,78.99 61.98,78.99 41.66,78.99 21.59,78.99 145.8,64.52 133.6,26.42 112.27,27.18 99.82,20.32 92.2,11.68 16,48.77 14.22,19.3 93.73,19.05 12.19,61.21 90.93,47.5 87.12,27.18 86.87,46.99 16.26,64.26 69.09,62.23 2.03,23.11 2.03,8.89 17.53,33.53 17.78,44.96 17.02,56.64 1.78,61.47 48.01,65.02 84.84,62.48 90.17,60.96 160.02,8.89 116.84,8.89 117.09,13.46 109.98,24.64 145.8,59.44
  pour Top (isolate 0.305): 143,101.6 143,70.1 158.75,70.1 158.75,101.6
  pour Top (isolate 0.305): 122.94,101.6 122.94,70.1 138.68,70.1 138.68,101.6
  pour Top (isolate 0.305): 102.87,101.6 102.87,70.1 118.62,70.1 118.62,101.6
  pour Top (isolate 0.305): 82.8,101.6 82.8,70.1 98.55,70.1 98.55,101.6
  pour Top (isolate 0.305): 62.74,101.6 62.74,70.1 78.49,70.1 78.49,101.6
  pour Top (isolate 0.305): 42.67,101.6 42.67,70.1 58.42,70.1 58.42,101.6
  pour Top (isolate 0.305): 22.61,101.6 22.61,70.1 38.35,70.1 38.35,101.6
  pour Top (isolate 0.305): 2.54,101.6 2.54,70.1 18.29,70.1 18.29,101.6
  pour Top (isolate 0.406, rank 2): -0.51,101.85 162.05,101.85 162.56,-0.25 0,-0.25 -0.25,49.28
  pour Bottom (isolate 0.406, rank 2): -0.25,101.85 162.05,101.85 162.56,-0.25 -0.25,-0.25
N$1
  Top 0.254: J2.24V(6) 149.58,81.28 151.34,83.04 151.34,84.31 152.04,85.01 156,85.01 156.25,84.75 156.25,82.06 154.85,80.66 R13.1
N$2
  Top 0.305: R11.1 D3.A
N$3
  Top 0.254: J3.24V(6) 129.51,81.28 131.28,83.04 131.28,84.31 131.97,85.01 135.93,85.01 136.19,84.75 136.19,82.06 134.53,80.4 R14.1
N$4
  Top 0.305: R12.1 D4.A
N$5
  Top 0.254: J5.24V(6) 109.45,81.28 111.21,83.04 111.21,84.31 111.9,85.01 115.87,85.01 116.12,84.75 116.12,82.06 114.72,80.66 R15.1
N$6
  Top 0.254: J4.24V(6) 89.38,81.28 91.14,83.04 91.14,84.31 91.84,85.01 95.8,85.01 96.06,84.75 96.06,82.06 94.65,80.66 R80.1
N$7
  Top 0.254: J6.24V(6) 69.32,81.28 71.08,83.04 71.08,84.31 71.77,85.01 75.74,85.01 75.99,84.75 75.99,82.06 74.59,80.66 R81.1
N$8
  Top 0.254: J7.24V(6) 49.25,81.28 51.01,83.04 51.01,84.31 51.71,85.01 55.67,85.01 55.92,84.75 55.92,82.89 54.78,81.74 R82.1
N$9
  Top 0.254: J8.24V(6) 29.18,81.28 30.95,83.04 30.95,84.31 31.64,85.01 35.6,85.01 35.86,84.75 35.86,82.06 34.46,80.66 R83.1
N$10
  Top 0.254: J9.24V(6) 9.12,81.28 10.88,83.04 10.88,84.31 11.57,85.01 15.54,85.01 15.79,84.75 15.79,82.89 14.9,81.99 R84.1
N$12
  Top 0.305: R10.1 D2.A
RESET1
  Top 0.305: R1.1 138.44,58.8 arc45 138.21,58.71 138,58.5 arc45 137.91,58.28 U1.3
SC0
  Top 0.305: U1.5 136.61,63.75 142.36,69.5 arc-45 142.59,69.6 158.62,69.6 arc45 158.84,69.69 159,69.85 159,74.93 158.66,75.27 R23.1 157.61,75.82 157.23,76.45 153.67,76.45 153.67,75.69 153.28,75.3 IC2.4
SC1
  Top 0.305: U1.7 135.31,63.75 135.35,63.79 135.35,64.22 138.94,67.81 138.94,74.93 138.6,75.27 R31.1 137.54,75.82 137.16,76.45 133.6,76.45 133.6,75.69 133.22,75.3 IC3.4
SC2
  Top 0.305: IC5.4 113.15,75.3 113.54,75.69 113.54,76.45 117.09,76.45 117.47,75.82 R47.1 118.53,75.27 118.87,74.93 118.87,69.75 119.89,68.73 133.35,68.73 134.01,68.07 U1.9
SC3
  Top 0.305: 132.74,63.6 132.74,63.5 | 132.74,63.5 U1.11 | IC4.4 93.08,75.3 93.47,75.69 93.47,76.45 97.03,76.45 97.41,75.82 R39.1 98.46,75.27 98.81,74.93 98.81,69.85 98.96,69.7 98.96,69.6 99.82,68.73 118.11,68.73 119.33,67.51 132.55,67.51 132.75,67.31 132.75,65.13 132.74,63.5
SC4
  Top 0.305: U1.14 132.71,49.53 arc-45 132.62,49.31 132.33,49.02 131.7,49.02 arc-45 131.48,49.12 128.26,52.33 arc-45 128.17,52.56 128.17,66.29 118.83,66.29 117.61,67.51 99.27,67.51 98.05,68.73 80.01,68.73 78.89,69.85 78.74,69.85 78.74,74.93 78.4,75.27 R55.1 77.34,75.82 76.96,76.45 73.41,76.45 73.41,75.69 73.02,75.3 IC6.4
SC5
  Top 0.305: U1.16 134.01,48.8 arc-45 133.92,48.57 133.24,47.9 arc-45 133.01,47.8 131.2,47.8 arc-45 130.97,47.9 127.04,51.83 arc-45 126.95,52.05 126.95,65.08 118.32,65.08 117.1,66.29 98.76,66.29 97.54,67.51 79.35,67.51 78.06,68.81 59.97,68.81 58.67,70.1 | IC7.4 52.95,75.3 53.34,75.69 53.34,76.45 56.9,76.45 57.28,75.82 R63.1 58.33,75.27 58.67,74.93 58.67,70.1 | 58.67,70.1 58.67,69.85
SC6
  Top 0.305: U1.18 135.31,48.07 arc-45 135.22,47.84 134.05,46.68 arc-45 133.83,46.58 130.69,46.58 arc-45 130.47,46.68 125.82,51.32 arc-45 125.73,51.55 125.73,63.86 117.82,63.86 116.6,65.08 98.25,65.08 97.03,66.29 78.85,66.29 77.55,67.59 59.46,67.59 58.42,68.63 39.73,68.63 38.76,69.6 38.76,69.7 38.61,69.85 38.61,74.93 38.27,75.27 R71.1 37.21,75.82 36.83,76.45 33.27,76.45 33.27,75.69 32.88,75.3 IC8.4
SC7
  Top 0.305: U1.20 136.61,47.23 arc-45 136.52,47.01 134.97,45.46 arc-45 134.74,45.36 130.19,45.36 arc-45 129.96,45.46 124.6,50.82 arc-45 124.51,51.04 124.51,62.64 117.31,62.64 116.09,63.86 97.75,63.86 96.53,65.08 78.34,65.08 77.05,66.37 58.96,66.37 57.92,67.41 39.22,67.41 38.13,68.5 19.79,68.5 18.54,69.75 18.54,74.93 18.2,75.27 R79.1 17.14,75.82 16.76,76.45 13.21,76.45 13.21,75.69 12.82,75.3 IC9.4
SCL
  Top 0.305: U1.22 137.91,47.23 135.38,44.7 135.33,44.76 129.62,44.76 123.9,50.48 123.9,62.03 117.06,62.03 115.84,63.25 97.5,63.25 96.28,64.47 78.09,64.47 76.79,65.76 58.71,65.76 57.66,66.8 35.81,66.8 35.31,66.29 R8.1
SD0  (via drill 0.35)
  Top 0.305: U1.4 137.26,63.5 137.93,64.17 142.81,68.97 143.08,68.97 143.02,68.99 159.19,68.99 159.77,69.57 v159.77,75.18 | IC2.2 153.3,74.3 154.27,75.27 R22.1 156.12,75.27 v156.21,75.18
  Bottom 0.305: v156.21,75.18 v159.77,75.18
SD1  (via drill 0.35)
  Top 0.305: U1.6 135.96,63.75 136,63.79 136,64.01 139.7,67.7 v139.7,75.18 | IC3.2 133.23,74.3 134.2,75.27 R30.1 136.06,75.27 v136.14,75.18
  Bottom 0.305: v136.14,75.18 v139.7,75.18
SD2  (via drill 0.35)
  Top 0.305: IC5.2 113.17,74.3 114.13,75.27 R46.1 115.99,75.27 v116.08,75.18 | v119.63,75.18 119.63,70.36 120.65,69.34 133.6,69.34 134.66,68.28 U1.8
  Bottom 0.305: v116.08,75.18 v119.63,75.18
SD3  (via drill 0.35)
  Top 0.305: U1.10 133.36,63.65 | 133.36,63.65 133.35,62.48 | IC4.2 93.1,74.3 94.07,75.27 R38.1 95.92,75.27 v96.01,75.18 | v99.57,75.18 99.57,69.85 100.08,69.34 118.36,69.34 119.58,68.12 133.1,68.12 133.36,67.86 133.36,63.65
  Bottom 0.305: v96.01,75.18 v99.57,75.18
SD4  (via drill 0.35)
  Top 0.305: IC6.2 73.03,74.3 74,75.27 R54.1 75.86,75.27 v75.95,75.18 | v79.5,75.18 79.5,70.1 80.26,69.34 98.3,69.34 99.52,68.12 117.86,68.12 119.08,66.9 128.78,66.9 128.78,52.99 128.87,52.9 128.87,52.59 130.48,50.98 U1.13
  Bottom 0.305: v75.95,75.18 v79.5,75.18
SD5  (via drill 0.35)
  Top 0.305: U1.15 133.36,49.16 arc-45 133.27,48.94 132.74,48.41 131.45,48.41 arc-45 131.23,48.51 127.65,52.08 arc-45 127.56,52.3 127.56,65.68 118.57,65.68 117.35,66.9 99.01,66.9 97.79,68.12 79.61,68.12 78.31,69.42 60.38,69.42 59.44,70.36 v59.44,75.18 | IC7.2 52.97,74.3 53.94,75.27 R62.1 55.79,75.27 v55.88,75.18
  Bottom 0.305: v55.88,75.18 v59.44,75.18
SD6  (via drill 0.35)
  Top 0.305: U1.17 134.66,48.3 133.65,47.29 arc-45 133.42,47.19 130.95,47.19 arc-45 130.72,47.29 126.43,51.58 arc-45 126.34,51.8 126.34,64.47 118.07,64.47 116.85,65.68 98.51,65.68 97.29,66.9 79.1,66.9 77.8,68.2 59.72,68.2 58.67,69.24 39.98,69.24 39.37,69.85 v39.37,75.18 | IC8.2 32.9,74.3 33.87,75.27 R70.1 35.73,75.27 v35.81,75.18
  Bottom 0.305: v35.81,75.18 v39.37,75.18
SD7  (via drill 0.35)
  Top 0.305: U1.19 135.96,47.45 arc-45 135.87,47.22 134.71,46.07 arc-45 134.49,45.97 130.44,45.97 arc-45 130.22,46.07 125.21,51.07 arc-45 125.12,51.3 125.12,63.25 117.56,63.25 116.34,64.47 98,64.47 96.78,65.68 78.59,65.68 77.3,66.98 59.21,66.98 58.17,68.02 39.48,68.02 38.38,69.11 20.04,69.11 19.3,69.85 v19.3,75.18 | IC9.2 12.84,74.3 13.8,75.27 R78.1 15.66,75.27 v15.75,75.18
  Bottom 0.305: v15.75,75.18 v19.3,75.18
SDA
  Top 0.305: U1.23 138.56,46.87 135.79,44.09 129.42,44.09 123.29,50.22 123.29,61.42 116.81,61.42 115.59,62.64 97.25,62.64 96.03,63.86 77.84,63.86 76.54,65.15 58.45,65.15 57.41,66.19 38.76,66.19 38.1,65.53 R9.1

### Text on the board
tPlace: GND | 3.3V | 5V | 5V | 3.3V | 24V | GND
tNames: I2C / CH:7 | I2C / CH:6 | I2C / CH:5 | I2C / CH:4 | I2C / CH:3 | I2C / CH:2 | I2C / CH:1 | I2C / CH:0 | SCL Pullup | SDA Pullup